# EAGLE design senseBox-Eye_v1.0 (EAGLE 9.6.2)
Assembly variants: komplett, ohne fuel-gauge

## Sheet 1 of 5
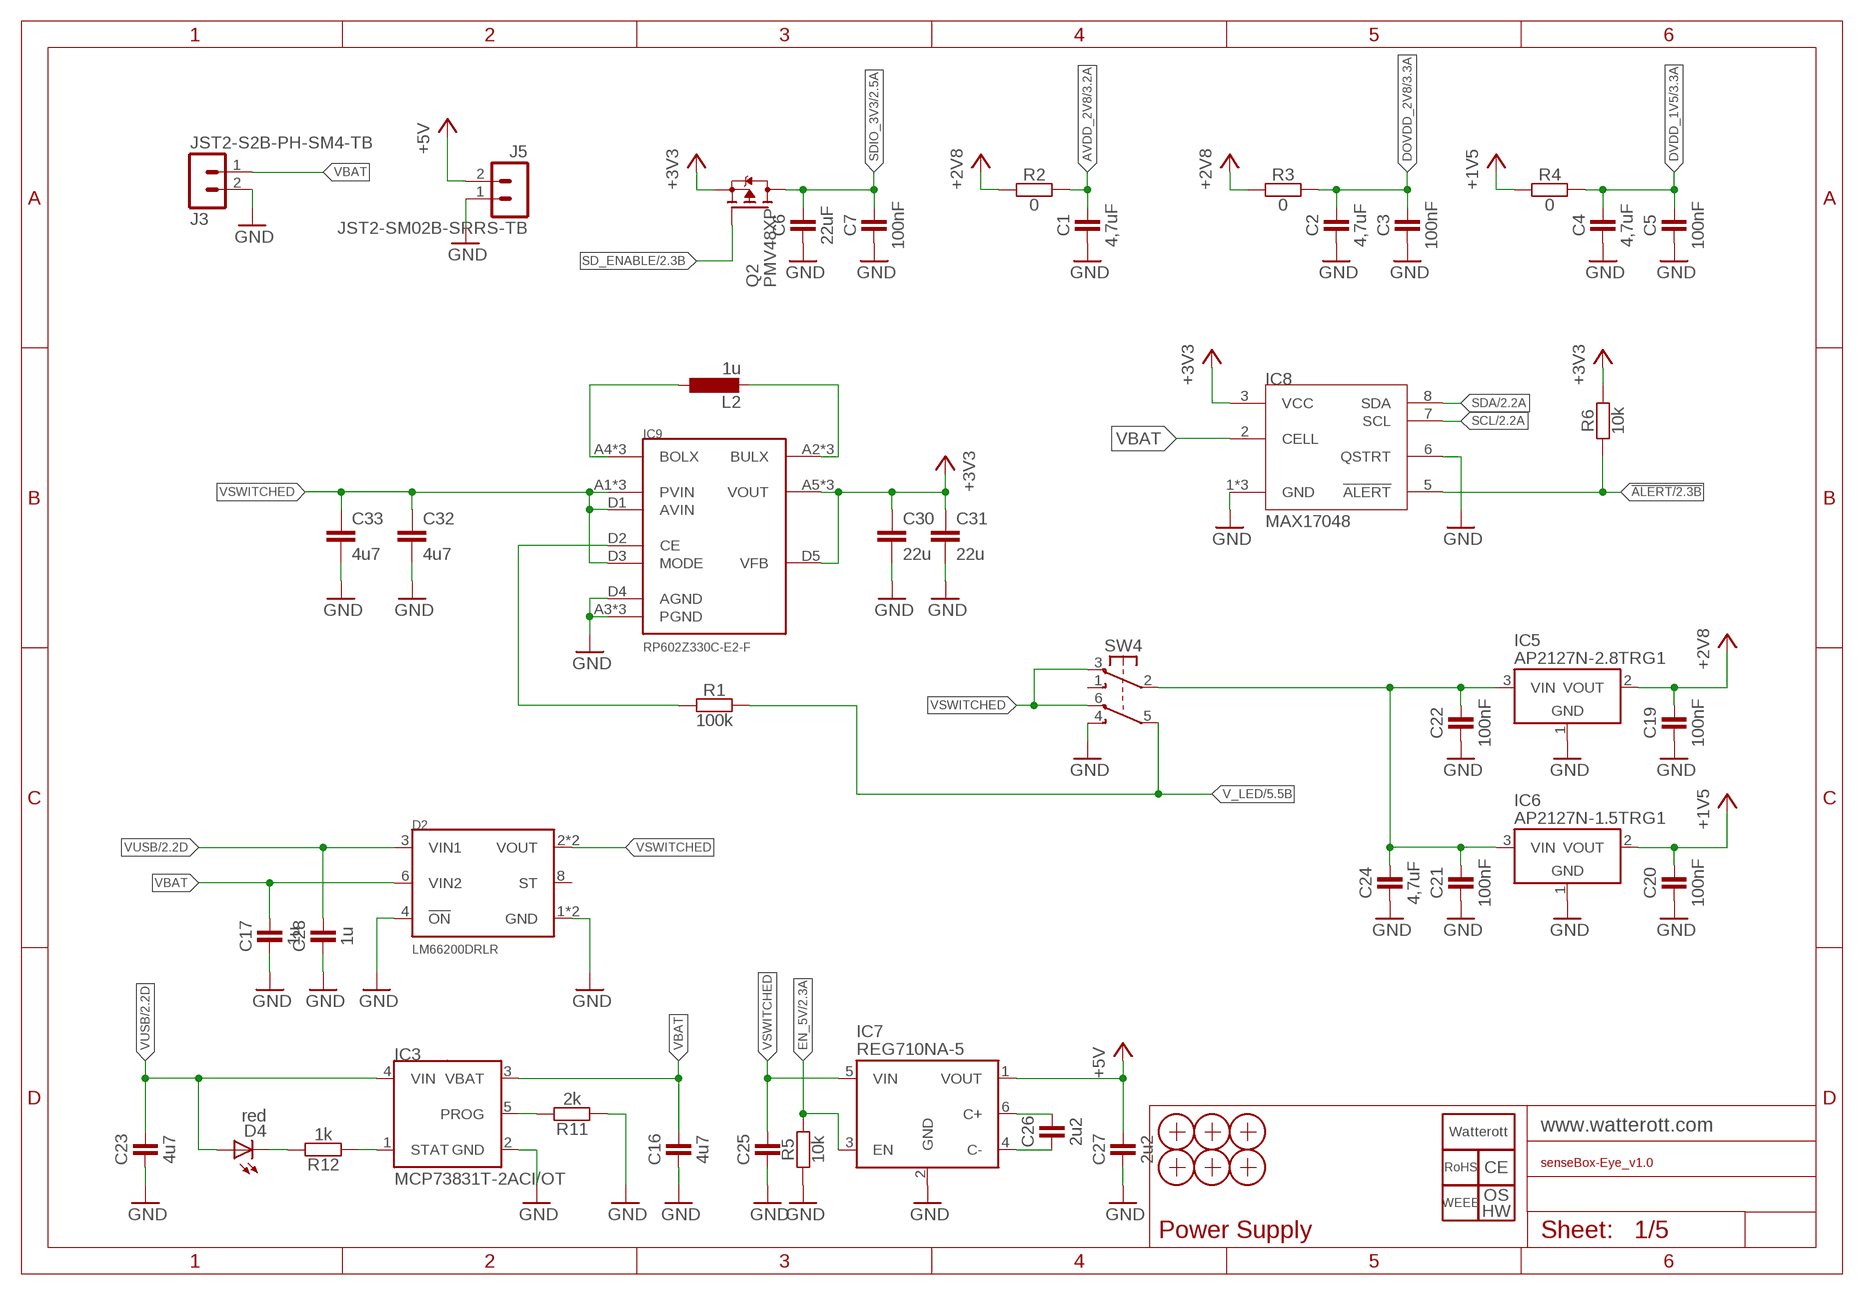
[diagram p0: schematic, sheet 1]

### Parts
C1  4,7uF  CAPACITOR-0402  [C0402]
C2  4,7uF  CAPACITOR-0402  [C0402]
C3  100nF  CAPACITOR-0402  [C0402]
C4  4,7uF  CAPACITOR-0402  [C0402]
C5  100nF  CAPACITOR-0402  [C0402]
C6  22uF  CAPACITOR-0402  [C0402]
C7  100nF  CAPACITOR-0402  [C0402]
C16  4u7  CAPACITOR-0402  [C0402]
C17  1u  CAPACITOR-0402  [C0402]
C19  100nF  CAPACITOR-0402  [C0402]
C20  100nF  CAPACITOR-0402  [C0402]
C21  100nF  CAPACITOR-0402  [C0402]
C22  100nF  CAPACITOR-0402  [C0402]
C23  4u7  CAPACITOR-0402  [C0402]
C24  4,7uF  CAPACITOR-0402  [C0402]
C25  CAPACITOR-0402  [C0402]
C26  2u2  CAPACITOR-0402  [C0402]
C27  2u2  CAPACITOR-0402  [C0402]
C28  1u  CAPACITOR-0402  [C0402]
C30  22u  C_22U_0805N  [0805N]
C31  22u  C_22U_0805N  [0805N]
C32  4u7  C_4U7_0603N  [0603N]
C33  4u7  C_4U7_0603N  [0603N]
D2  LM66200DRLR  LM66200  [SOT-5X3]
D4  red  LED_RED_0603N  [0603N]
IC3  MCP73831T-2ACI/OT  MCP73831_MCP73831T-2ACI/OT_SOT23-5  [SOT23-5]
IC5  AP2127N-2.8TRG1  VREG-TS9011-3V3  [SOT23]
IC6  AP2127N-1.5TRG1  VREG-TS9011-3V3  [SOT23]
IC7  REG710NA-5  [SOT23-6]
IC8  MAX17048  MAX1704X  [UDFN8]  (not fitted in variant ohne fuel-gauge)
IC9  RP602Z330C-E2-F  RP602_RP602Z330C-E2-F_WLCSP-20-P1  [WLCSP-20-P1]
J3  JST2-S2B-PH-SM4-TB  [JST_S2B-PH-SM4-TB]
J5  JST2-SM02B-SRRS-TB  [JST_SM02B-SRSS-TB]
L2  1u  L_WE-LQS-1U_5040  [5040]
LOGO2  LOGO_CE-2  [CE_2MM]
LOGO3  LOGO_OSHW-2  [OSHW_2MM]
LOGO4  LOGO_ROHS-2  [ROHS_2MM]
LOGO5  LOGO_WEEE-4  [WEEE_4MM]
LOGO6  LOGO_SPARK-2  [SPARK_2MM]
Q2  PMV48XP  MOSFET-P_PMV48XP_SOT23'  [SOT23]
R1  100k  RESISTOR-0402  [C0402]
R2  0  RESISTOR-0402  [C0402]
R3  0  RESISTOR-0402  [C0402]
R4  0  RESISTOR-0402  [C0402]
R5  10k  RESISTOR-0402  [C0402]
R6  10k  RESISTOR-0402  [C0402]  (not fitted in variant ohne fuel-gauge)
R11  2k  RESISTOR-0402  [C0402]
R12  1k  RESISTOR-0402  [C0402]
SW4  SW-2UM-CUS22B  [CUS22B]
X1  PASSER-04  [PASSER_04MM]
X2  PASSER-04  [PASSER_04MM]
X3  PASSER-04  [PASSER_04MM]
X4  PASSER-04  [PASSER_04MM]
X5  PASSER-04  [PASSER_04MM]
X6  PASSER-04  [PASSER_04MM]

### Nets
!ALERT: IC8.5(!ALERT) R6.1 ; also sheet 2
+1V5: C20.2 IC6.2(VOUT) R4.1
+2V8: C19.2 IC5.2(VOUT) R2.1 R3.1
+3V3: C30.1 C31.1 IC8.3(VCC) IC9.A5(VOUT) IC9.B5(VOUT) IC9.C5(VOUT) IC9.D5(VFB) Q2.2(S) R6.2 ; also sheet 2,4,5
+5V: C27.2 IC7.1(VOUT) J5.2
AVDD_2V8: C1.2 R2.2 ; also sheet 3
BOLX: IC9.A4(BOLX) IC9.B4(BOLX) IC9.C4(BOLX) L2.1
BULX: IC9.A2(BULX) IC9.B2(BULX) IC9.C2(BULX) L2.2
DOVDD_2V8: C2.2 C3.2 R3.2 ; also sheet 3
DVDD_1V5: C4.2 C5.2 R4.2 ; also sheet 3
EN_5V: IC7.3(EN) R5.2 ; also sheet 2
ENABLE_3V3: IC9.D2(CE) R1.1
GND: C1.1 C2.1 C3.1 C4.1 C5.1 C6.1 C7.1 C16.1 C17.1 C19.1 C20.1 C21.1 C22.1 C23.1 C24.1 C25.1 C27.1 C28.1 C30.2 C31.2 C32.2 C33.2 D2.1(GND) D2.4(!ON) D2.5(GND) IC3.2(GND) IC5.1(GND) IC6.1(GND) IC7.2(GND) IC8.1(GND) IC8.4(GND) IC8.6(QSTRT) IC8.TP(GND) IC9.A3(PGND) IC9.B3(PGND) IC9.C3(PGND) IC9.D4(AGND) J3.2 J5.1 R5.1 R11.1 SW4.4(NO2) ; also sheet 2,3,4,5
N$5: C26.2 IC7.6(C+)
N$6: C26.1 IC7.4(C-)
N$8: D4.C R12.2
N$9: IC3.1(STAT) R12.1
N$10: IC3.5(PROG) R11.2
SCL: IC8.7(SCL) ; also sheet 2,5
SD_ENABLE: Q2.1(G) ; also sheet 2
SDA: IC8.8(SDA) ; also sheet 2,5
SDIO_3V3: C6.2 C7.2 Q2.3(D) ; also sheet 2
V_LED: R1.2 SW4.5(C2) ; also sheet 5
VBAT: C16.2 C17.2 D2.6(VIN2) IC3.3(VBAT) IC8.2(CELL) J3.1
VIN: C21.2 C22.2 C24.2 IC5.3(VIN) IC6.3(VIN) SW4.2(C1)
VSWITCHED: C25.2 C32.1 C33.1 D2.2(VOUT) D2.7(VOUT) IC7.5(VIN) IC9.A1(PVIN) IC9.B1(PVIN) IC9.C1(PVIN) IC9.D1(AVIN) IC9.D3(MODE) SW4.3(NC1) SW4.6(NC2)
VUSB: C23.2 C28.2 D2.3(VIN1) D4.A IC3.4(VIN) ; also sheet 2
Unconnected: D2.8(ST) SW4.1(NO1)

### Notes on the sheet
- Power Supply

## Sheet 2 of 5
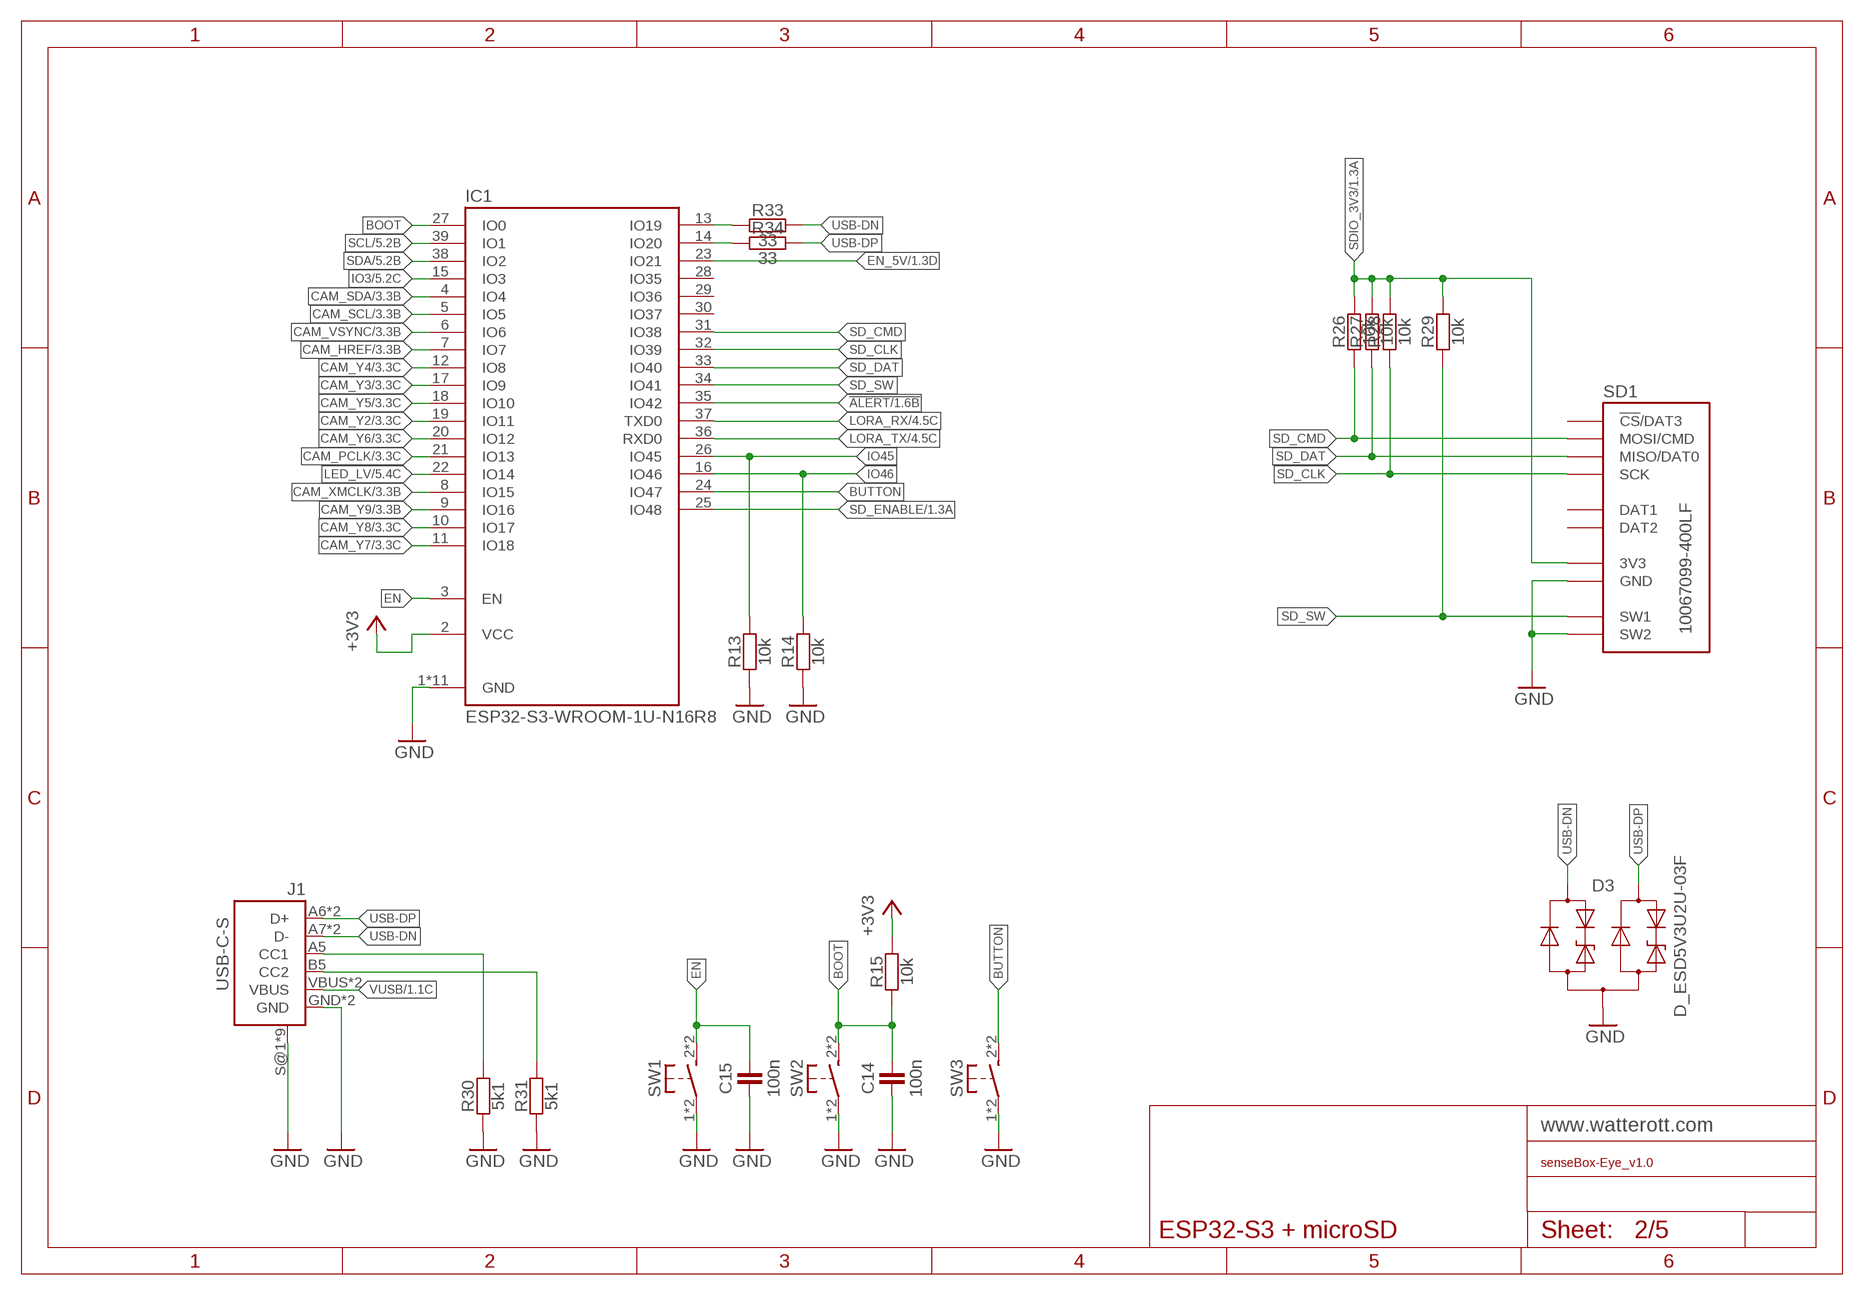
[diagram p1: schematic, sheet 2]

### Parts
C14  100n  CAPACITOR-0402  [C0402]
C15  100n  CAPACITOR-0402  [C0402]
D3  D_ESD5V3U2U-03F  [SOT723]
IC1  ESP32-S3-WROOM-1U-N16R8  ESP32_S3-WROOM-1  [ESP32-S3-WROOM-1U]
J1  USB-C-S  [USB-C-S]
R13  10k  RESISTOR-0402  [C0402]
R14  10k  RESISTOR-0402  [C0402]
R15  10k  RESISTOR-0402  [C0402]
R26  10k  RESISTOR-0402  [C0402]
R27  10k  RESISTOR-0402  [C0402]
R28  10k  RESISTOR-0402  [C0402]
R29  10k  RESISTOR-0402  [C0402]
R30  5k1  RESISTOR-0402  [C0402]
R31  5k1  RESISTOR-0402  [C0402]
R33  33  RESISTOR-0402  [C0402]
R34  33  RESISTOR-0402  [C0402]
SD1  10067099-400LF  SD-CARD-MSD47  [SD_47309XXXX]
SW1  SW-TACTILE-TL3305  [TL3305]
SW2  SW-TACTILE-TL3305  [TL3305]
SW3  SW-TACTILE-TL3305  [TL3305]

### Nets
!ALERT: IC1.35(IO42) ; also sheet 1
+3V3: IC1.2(VCC) R15.2 ; also sheet 1,4,5
BOOT: C14.2 IC1.27(IO0) R15.1 SW2.2(S1) SW2.3(S1)
BUTTON: IC1.24(IO47) SW3.2(S1) SW3.3(S1)
CAM_HREF: IC1.7(IO7) ; also sheet 3
CAM_PCLK: IC1.21(IO13) ; also sheet 3
CAM_SCL: IC1.5(IO5) ; also sheet 3
CAM_SDA: IC1.4(IO4) ; also sheet 3
CAM_VSYNC: IC1.6(IO6) ; also sheet 3
CAM_XMCLK: IC1.8(IO15) ; also sheet 3
CAM_Y2: IC1.19(IO11) ; also sheet 3
CAM_Y3: IC1.17(IO9) ; also sheet 3
CAM_Y4: IC1.12(IO8) ; also sheet 3
CAM_Y5: IC1.18(IO10) ; also sheet 3
CAM_Y6: IC1.20(IO12) ; also sheet 3
CAM_Y7: IC1.11(IO18) ; also sheet 3
CAM_Y8: IC1.10(IO17) ; also sheet 3
CAM_Y9: IC1.9(IO16) ; also sheet 3
CC1: J1.A5(CC1) R30.2
CC2: J1.B5(CC2) R31.2
EN: C15.2 IC1.3(EN) SW1.2(S1) SW1.3(S1)
EN_5V: IC1.23(IO21) ; also sheet 1
GND: C14.1 C15.1 D3.3(A) IC1.1(GND) IC1.40(GND) IC1.P$1(GND) IC1.P$2(GND) IC1.P$3(GND) IC1.P$4(GND) IC1.P$5(GND) IC1.P$6(GND) IC1.P$7(GND) IC1.P$8(GND) IC1.P$9(GND) J1.GND J1.GND2(GND) J1.S@1(SHIELD) J1.S@2(SHIELD) J1.S@3(SHIELD) J1.S@4(SHIELD) J1.S@5(SHIELD) J1.S@6(SHIELD) J1.S@7(SHIELD) J1.S@8(SHIELD) J1.S@9(SHIELD) R13.1 R14.1 R30.1 R31.1 SD1.GND SD1.GND@1(GND) SD1.GND@2(GND) SD1.SW2 SW1.1 SW1.4(P1) SW2.1 SW2.4(P1) SW3.1 SW3.4(P1) ; also sheet 1,3,4,5
IO3: IC1.15(IO3) ; also sheet 5
IO19: IC1.13(IO19) R33.1
IO20: IC1.14(IO20) R34.1
IO45: IC1.26(IO45) R13.2
IO46: IC1.16(IO46) R14.2
LED_LV: IC1.22(IO14) ; also sheet 5
LORA_RX: IC1.37(TXD0) ; also sheet 4
LORA_TX: IC1.36(RXD0) ; also sheet 4
SCL: IC1.39(IO1) ; also sheet 1,5
SD_CLK: IC1.32(IO39) R28.1 SD1.SCK
SD_CMD: IC1.31(IO38) R26.1 SD1.MOSI(MOSI/CMD)
SD_DAT: IC1.33(IO40) R27.1 SD1.MISO(MISO/DAT0)
SD_ENABLE: IC1.25(IO48) ; also sheet 1
SD_SW: IC1.34(IO41) R29.1 SD1.SW1
SDA: IC1.38(IO2) ; also sheet 1,5
SDIO_3V3: R26.2 R27.2 R28.2 R29.2 SD1.VCC(3V3) ; also sheet 1
USB-DN: D3.1(C1) J1.A7(D-) J1.B7(D-) R33.2
USB-DP: D3.2(C2) J1.A6(D+) J1.B6(D+) R34.2
VUSB: J1.VBUS J1.VBUS2(VBUS) ; also sheet 1
Unconnected: IC1.28(IO35) IC1.29(IO36) IC1.30(IO37) SD1.CS(!CS!/DAT3) SD1.DAT1 SD1.DAT2

### Notes on the sheet
- ESP32-S3 + microSD

## Sheet 3 of 5
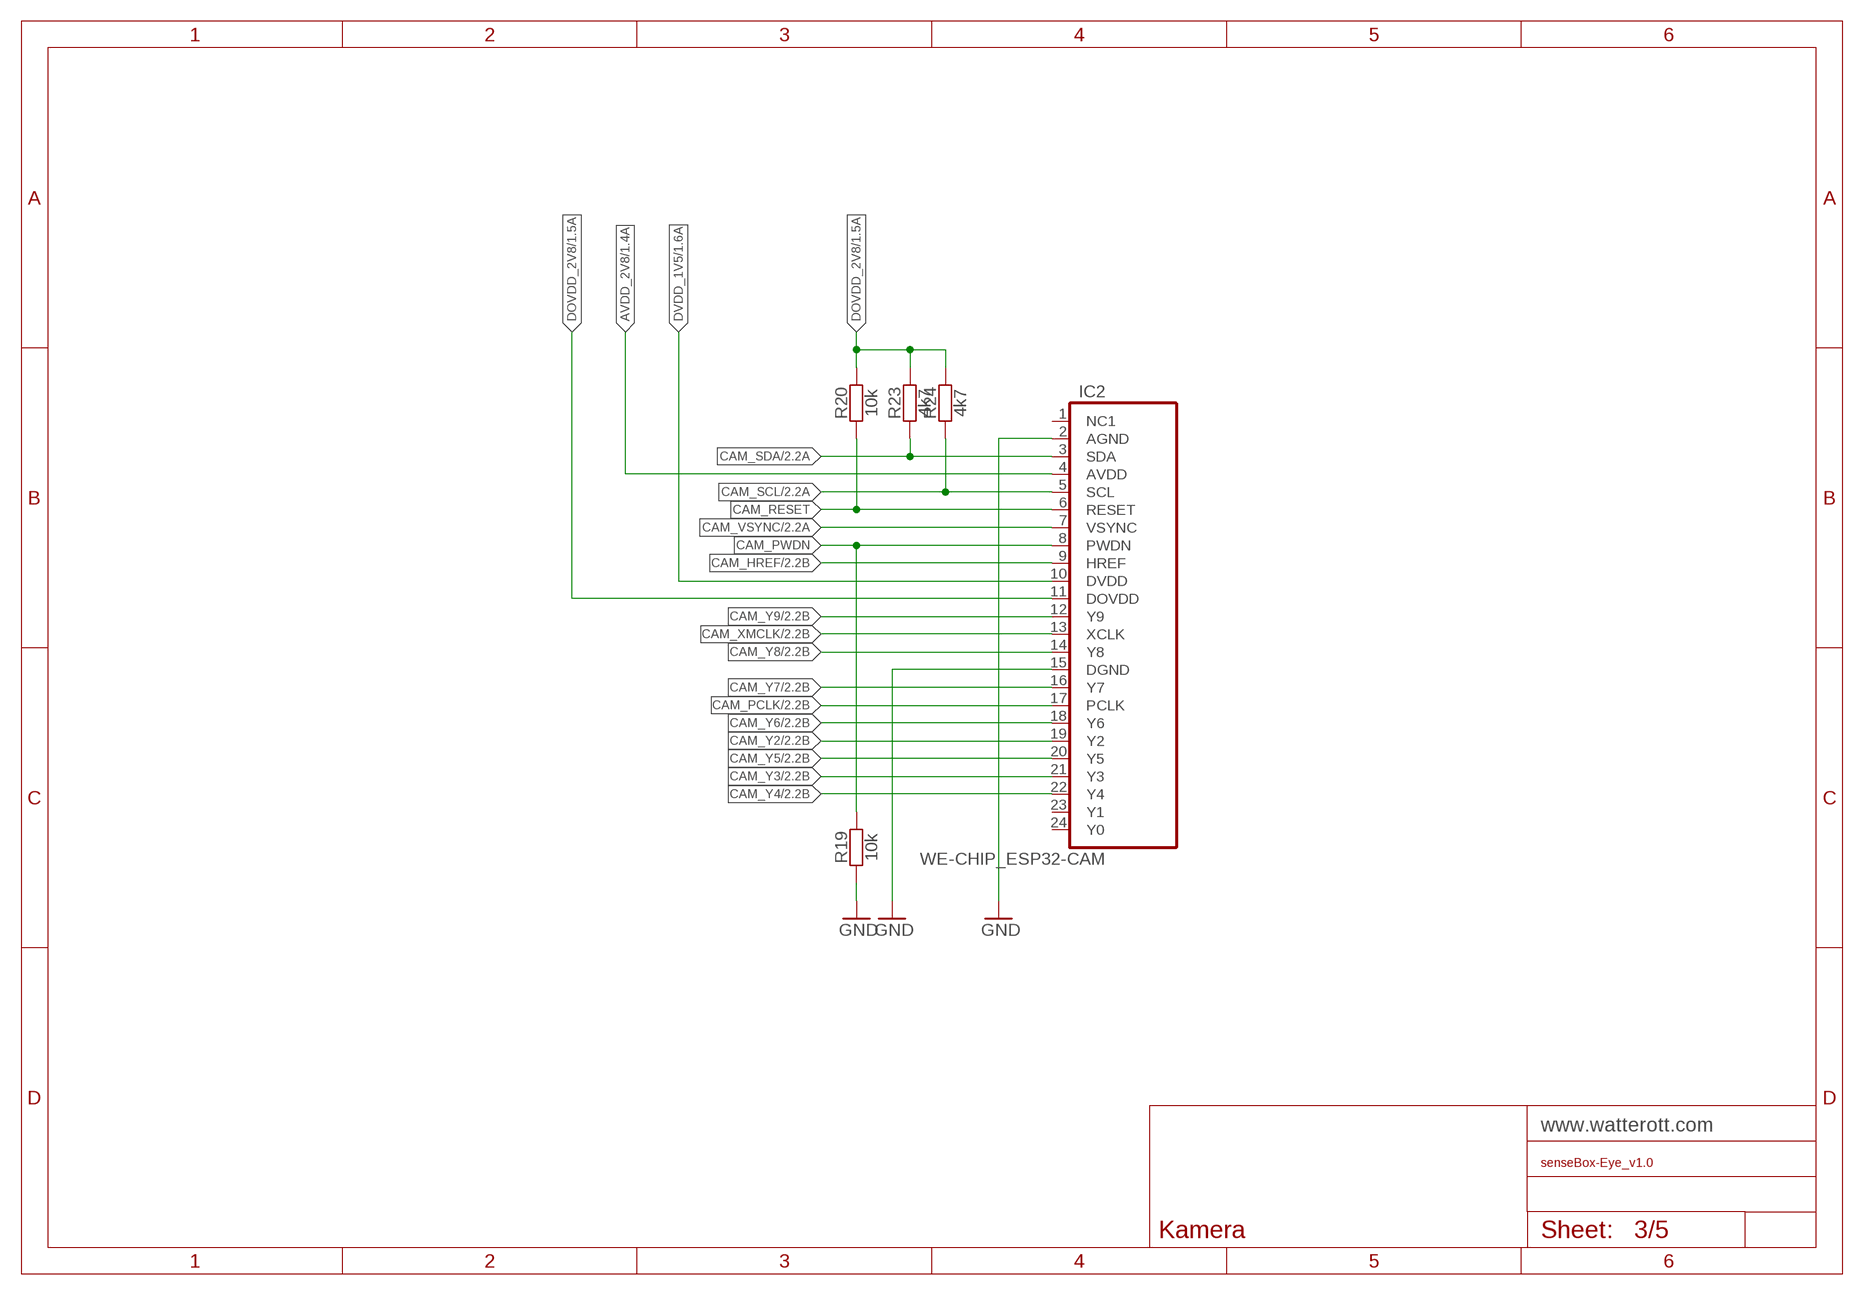
[diagram p2: schematic, sheet 3]

### Parts
IC2  WE-CHIP_ESP32-CAM  [WE-CHIP_FPC24-0.5-CAM]
R19  10k  RESISTOR-0402  [C0402]
R20  10k  RESISTOR-0402  [C0402]
R23  4k7  RESISTOR-0402  [C0402]
R24  4k7  RESISTOR-0402  [C0402]

### Nets
AVDD_2V8: IC2.4(AVDD) ; also sheet 1
CAM_HREF: IC2.9(HREF) ; also sheet 2
CAM_PCLK: IC2.17(PCLK) ; also sheet 2
CAM_PWDN: IC2.8(PWDN) R19.2
CAM_RESET: IC2.6(RESET) R20.1
CAM_SCL: IC2.5(SCL) R24.1 ; also sheet 2
CAM_SDA: IC2.3(SDA) R23.1 ; also sheet 2
CAM_VSYNC: IC2.7(VSYNC) ; also sheet 2
CAM_XMCLK: IC2.13(XCLK) ; also sheet 2
CAM_Y2: IC2.19(Y2) ; also sheet 2
CAM_Y3: IC2.21(Y3) ; also sheet 2
CAM_Y4: IC2.22(Y4) ; also sheet 2
CAM_Y5: IC2.20(Y5) ; also sheet 2
CAM_Y6: IC2.18(Y6) ; also sheet 2
CAM_Y7: IC2.16(Y7) ; also sheet 2
CAM_Y8: IC2.14(Y8) ; also sheet 2
CAM_Y9: IC2.12(Y9) ; also sheet 2
DOVDD_2V8: IC2.11(DOVDD) R20.2 R23.2 R24.2 ; also sheet 1
DVDD_1V5: IC2.10(DVDD) ; also sheet 1
GND: IC2.15(DGND) R19.1 ; also sheet 1,2,4,5
N$4: IC2.2(AGND) ; supply symbol labelled GND
Unconnected: IC2.1(NC1) IC2.23(Y1) IC2.24(Y0)

### Notes on the sheet
- Kamera

## Sheet 4 of 5
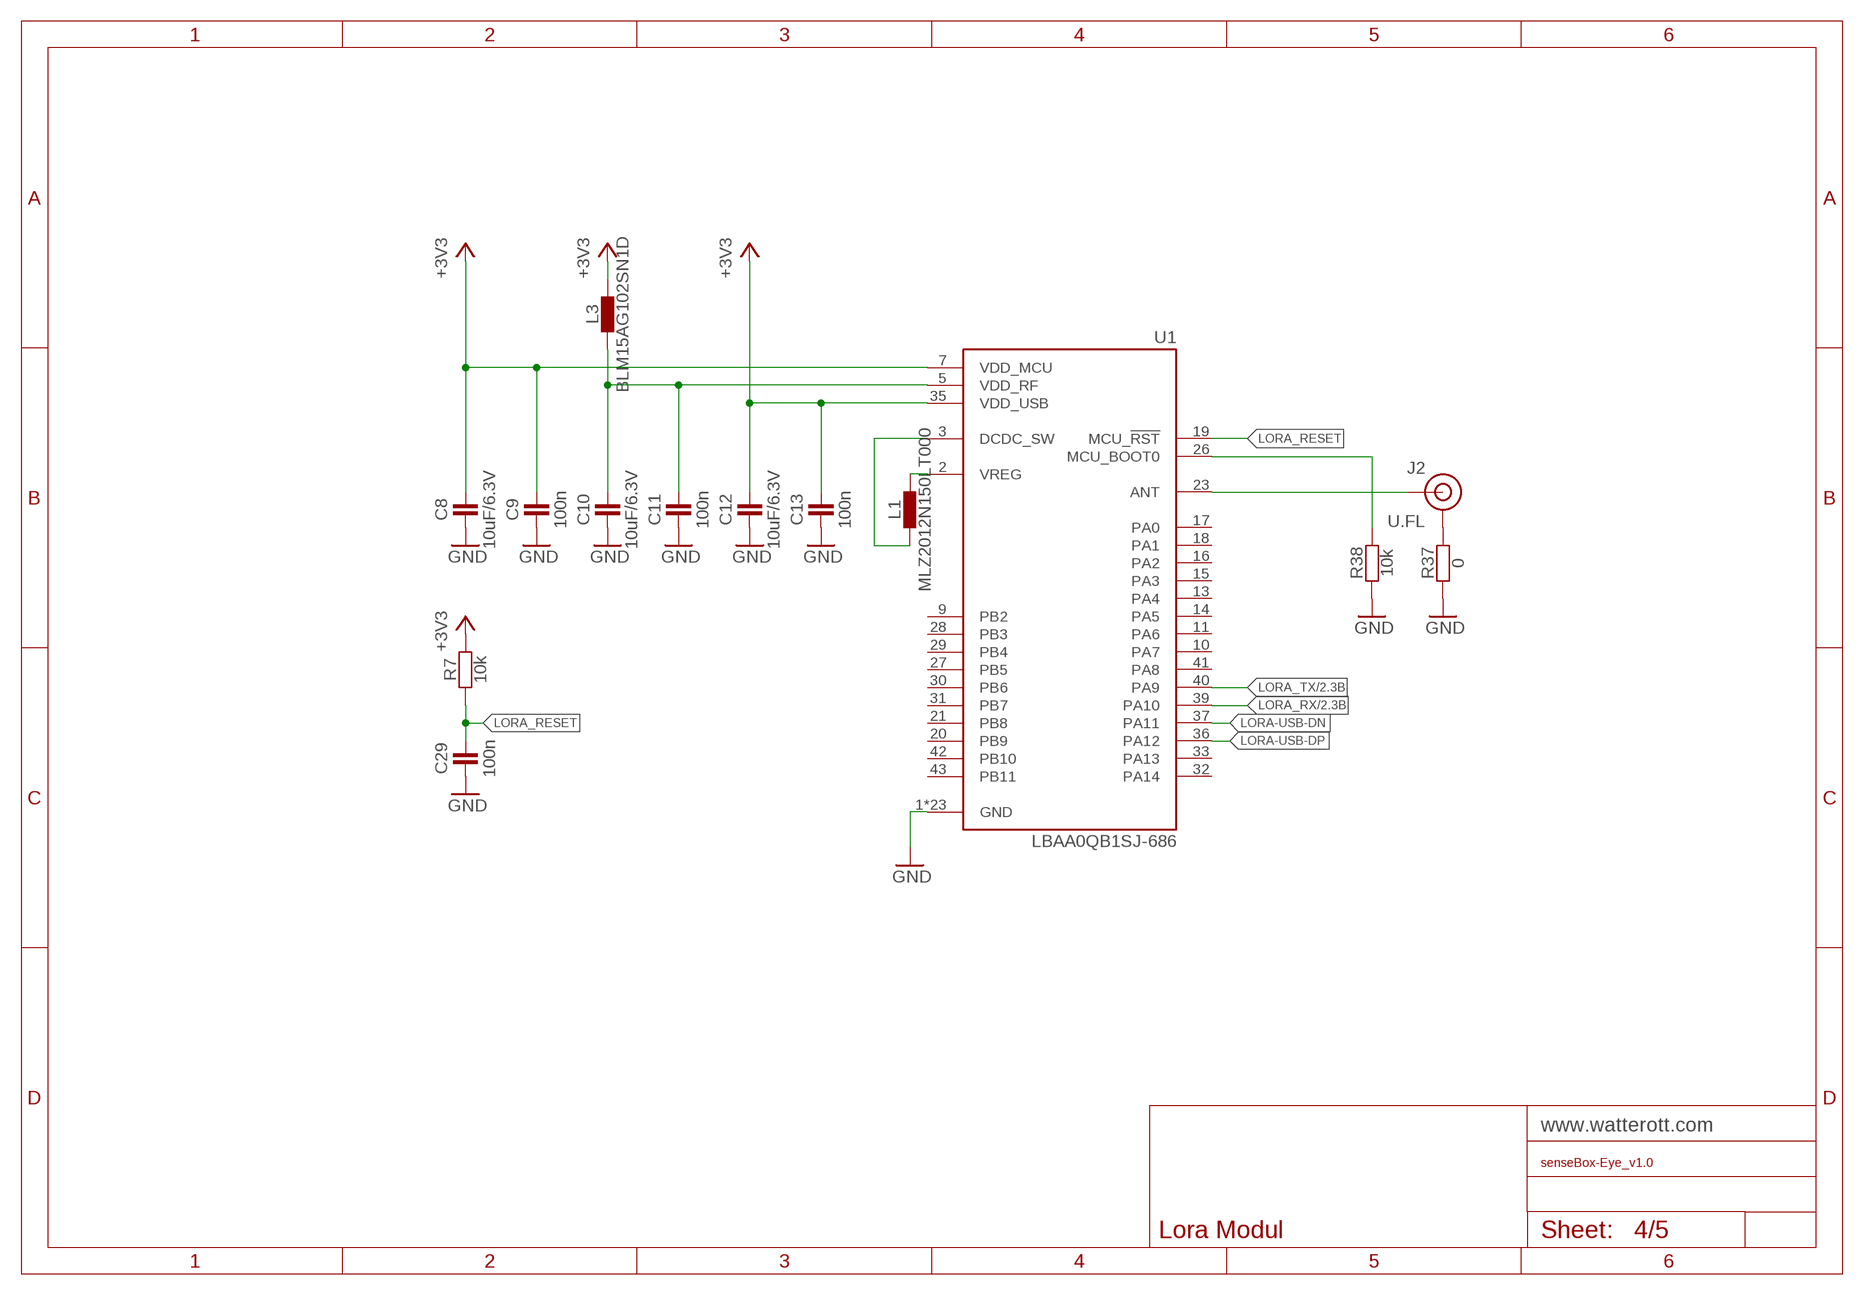
[diagram p3: schematic, sheet 4]

### Parts
C8  10uF/6.3V  CAPACITOR-0402  [C0402]
C9  100n  CAPACITOR-0402  [C0402]
C10  10uF/6.3V  CAPACITOR-0402  [C0402]
C11  100n  CAPACITOR-0402  [C0402]
C12  10uF/6.3V  CAPACITOR-0402  [C0402]
C13  100n  CAPACITOR-0402  [C0402]
C29  100n  CAPACITOR-0402  [C0402]
J2  U.FL  [U.FL]
L1  MLZ2012N150LT000  INDUCTOR-0805  [C0805]
L3  BLM15AG102SN1D  INDUCTOR-0402  [C0402]
R7  10k  RESISTOR-0402  [C0402]
R37  0  RESISTOR-0402  [C0402]
R38  10k  RESISTOR-0402  [C0402]
U1  LBAA0QB1SJ-686  LBAA0QB1SJ-296  [MODULE_LBAA0QB1SJ-296]

### Nets
+3V3: C8.2 C9.2 C12.2 C13.2 L3.2 R7.2 U1.7(VDD_MCU) U1.35(VDD_USB) ; also sheet 1,2,5
ANT: J2.FEED(SIGNAL) U1.23(ANT)
GND: C8.1 C9.1 C10.1 C11.1 C12.1 C13.1 C29.1 R37.1 R38.1 U1.1(GND) U1.4(GND) U1.6(GND) U1.8(GND) U1.12(GND) U1.22(GND) U1.24(GND) U1.25(GND) U1.34(GND) U1.38(GND) U1.44(GND) U1.45(GND) U1.46(GND) U1.47(GND) U1.48(GND) U1.49(GND) U1.50(GND) U1.51(GND) U1.52(GND) U1.53(GND) U1.54(GND) U1.55(GND) U1.56(GND) ; also sheet 1,2,3,5
LORA-USB-DN: U1.37(PA11)
LORA-USB-DP: U1.36(PA12)
LORA_RESET: C29.2 R7.1 U1.19(MCU_!RST)
LORA_RX: U1.39(PA10) ; also sheet 2
LORA_TX: U1.40(PA9) ; also sheet 2
MCU-BOOT0: R38.2 U1.26(MCU_BOOT0)
N$1: L1.2 U1.3(DCDC_SW)
N$2: L1.1 U1.2(VREG)
N$3: J2.1(GND) J2.2(GND) R37.2
N$7: C10.2 C11.2 L3.1 U1.5(VDD_RF)
Unconnected: U1.9(PB2) U1.10(PA7) U1.11(PA6) U1.13(PA4) U1.14(PA5) U1.15(PA3) U1.16(PA2) U1.17(PA0) U1.18(PA1) U1.20(PB9) U1.21(PB8) U1.27(PB5) U1.28(PB3) U1.29(PB4) U1.30(PB6) U1.31(PB7) U1.32(PA14) U1.33(PA13) U1.41(PA8) U1.42(PB10) U1.43(PB11)

### Notes on the sheet
- Lora Modul

## Sheet 5 of 5
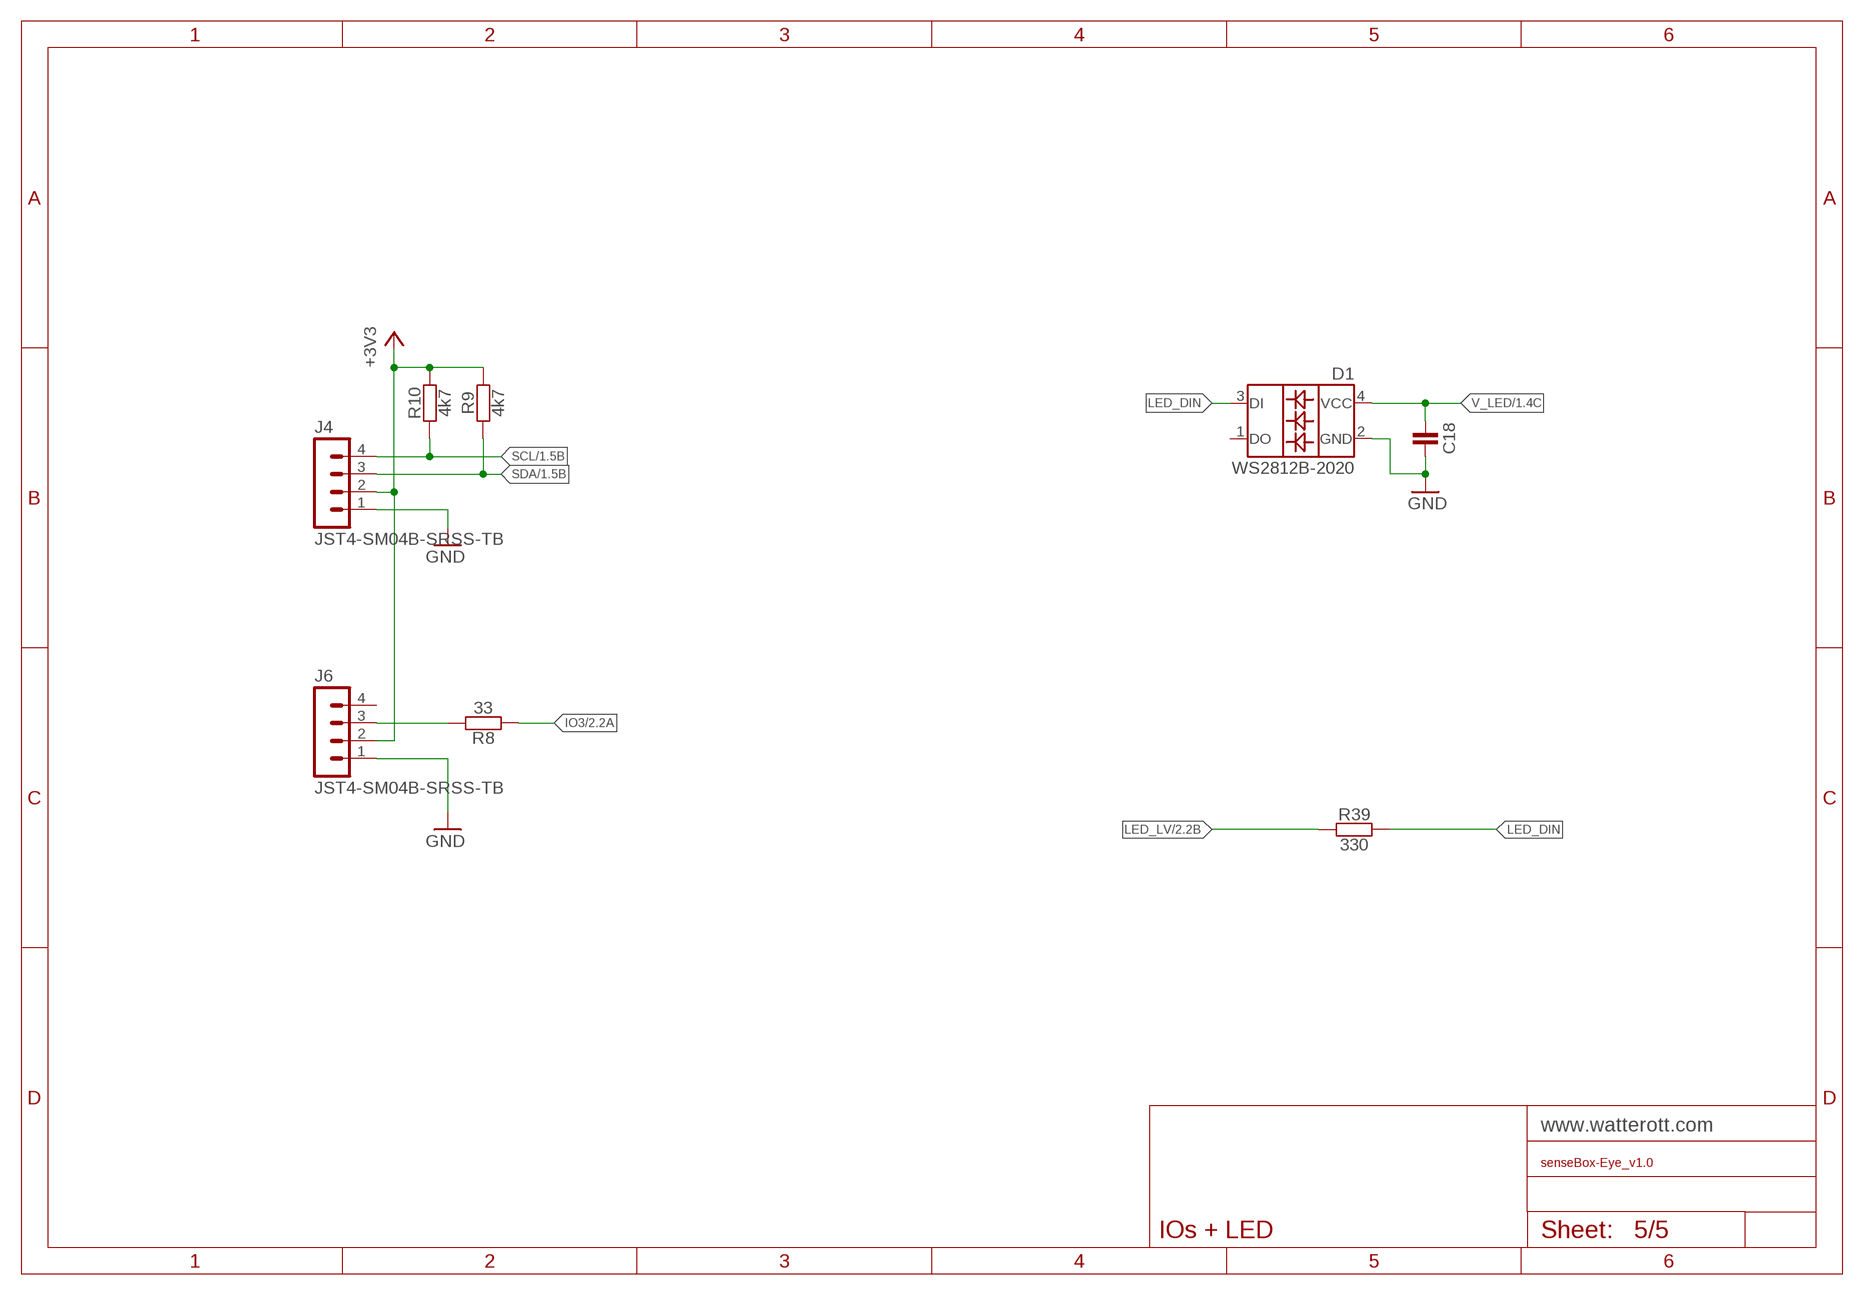
[diagram p4: schematic, sheet 5]

### Parts
C18  CAPACITOR-0402  [C0402]
D1  WS2812B-2020  [WS2812_2020]
J4  JST4-SM04B-SRSS-TB  [JST_SM04B-SRSS-TB]
J6  JST4-SM04B-SRSS-TB  [JST_SM04B-SRSS-TB]
R8  33  RESISTOR-0402  [C0402]
R9  4k7  RESISTOR-0402  [C0402]
R10  4k7  RESISTOR-0402  [C0402]
R39  330  RESISTOR-0402  [C0402]

### Nets
+3V3: J4.2 J6.2 R9.1 R10.1 ; also sheet 1,2,4
GND: C18.1 D1.2(GND) J4.1 J6.1 ; also sheet 1,2,3,4
IO3: R8.2 ; also sheet 2
LED_DIN: D1.3(DI) R39.2
LED_LV: R39.1 ; also sheet 2
N$13: J6.3 R8.1
SCL: J4.4 R10.2 ; also sheet 1,2
SDA: J4.3 R9.2 ; also sheet 1,2
V_LED: C18.2 D1.4(VCC) ; also sheet 1
Unconnected: D1.1(DO) J6.4

### Notes on the sheet
- IOs + LED

## Library data of the parts
C1-C29 = we-rcl:CAPACITOR: Capacitor ...2.2uF @ 6.3V -> 0402 ...4.7uF @ 6.3V -> 0603 ...10uF @ 16V -> 0805 ...22uF @ 25V -> 1206
C30 C31 = BE_capacitor:C: Capacitor; BE#: 208; DIELECTRIC: X5R; VOLTAGE: 6V3
C32 C33 = BE_capacitor:C: Capacitor; BE#: 284; DIELECTRIC: X5R; VOLTAGE: 6V3
D1 = we-opto:WS2812B: WS2812 RGB LED (built-in driver)
D2 = BE_diode:LM66200: LM66200 1.6-5V, 2.5A Dual Ideal Diode with Automatic Switchover; BE#: 2291
D3 = we-rcl:D_ESD5V3U2U: ESD5V3U2U TVS Diode (Uni-directional Ultra Low ESD) Vrwm=5.3V, 0.4pF@1MHz; DIGIKEY: ESD5V3U2U-03F H6327DKR-ND
D4 = BE_opto:LED: Single LED; BE#: 224
IC1 = we-chip:ESP32_S3-WROOM-1: Espressif ESP32-S3-WROOM-1U ESP32 WiFi/WLAN + Bluetooth/BLE Module<
IC2 = SenseBox-Eye:WE-CHIP_ESP32-CAM: ESP32-CAM OV2640 Camera module
IC3 = BE_dcdc:MCP73831: Miniature Single-Cell, Fully Integrated Li-Ion, Li-Polymer Charge Management Controllers up to 500mA; BE#: 2283
IC5 IC6 = we-power:VREG: Voltage Regulator LDOs Taiwan Semi TS1117 800mA max 15V - compatible On Semi NCP1117 1A max 20V - compatible Diodes AP2111H 0.6A max 6V (0.25V@0.6A) - compatible Diodes AP2114H 1A max 6V (0.45V@1A) Taiwan Semi TS9011 250mA max 12V - compatible Diodes AP2210 300mA max 15V - compatible Microchip MCP1700 250mA max 6.5V - compatible Microchip MCP1702 250mA max 13V - compatible Microchip MCP1703 250mA max 16V - compatible Microchip MCP1754 150mA max 16V Taiwan Semi TS5204 80mA max 16V (low noise) DC/DC Converter Modules Recom R-78Ex.x-1.0-W36 1A max 28V - compatible CUI V78xx-2000 2A max 18V Murata OKI-78SR-x.x/1.5-W36 1.5A max 36V
IC7 = we-power:REG710NA: TI REG710xx Charge Pump with Regulated Output TI REG710xx (60mA) 5.5V - REG71055 5.0V - REG710NA-5 or REG71050 3.3V - REG710NA-3.3 3.0V - REG710NA-3 2.7V - REG710NA-2.7 2.5V - REG710NA-2.5 Diodes AP3602 (100mA) 5.0V - AP3602A 4.5V - AP3602B OnSemi CAT3200 (100mA) 5.0V - CAT3200TDI
IC8 = we-power:MAX1704X
IC9 = BE_dcdc:RP602: 1.5 A PWM/VFM Buck-Boost DC/DC Converter with Synchronous Rectifier; BE#: 2281
J1 = we-con:USB-C: USB-C Connector Hroparts TYPE-C-31-M-12 or Jing C167321 or XKB U262-161N-4BVC11 Up: XKB U263-241N-4BQC11-1 or Wuerth 632722110112
J2 = we-con:U.FL: U.FL Connector
J3 J5 = we-con:JST2: JST Connector
J4 J6 = we-con:JST4: JST Connector
L1 L3 = we-rcl:INDUCTOR: Inductor Ferrite Bead - Murata BLM18PG 0603 3.0A 33Ohm @ 100MHz -> BLM18PG330SN1D 0603 2.0A 120Ohm @ 100MHz -> BLM18PG121SN1D 0603 1.4A 220Ohm @ 100MHz -> BLM18PG221SN1D 0603 1.2A 330Ohm @ 100MHz -> BLM18PG331SN1D 0603 1.0A 470Ohm @ 100MHz -> BLM18PG471SN1D L4040 BOURNS SRN4018 Serie
L2 = BE_inductor:L: Inductor; BE#: 2282; CURRENT: 4.9; INDUCTANCE: 1u
LOGO2 = we-symbol:LOGO_CE: CE Logo
LOGO3 = we-symbol:LOGO_OSHW: Open-Source-Hardware Logo
LOGO4 = we-symbol:LOGO_ROHS: RoHS Logo
LOGO5 = we-symbol:LOGO_WEEE: WEEE Logo
LOGO6 = we-symbol:LOGO_SPARK: Watterott electronic Logo
Q2 = BE_transistor:MOSFET-P: Single P-Channel Mosfet; BE#: 271; CURRENT: 3.5; VOLTAGE: 20
R1-R15 R19 R20 R23 R24 R26-R31 R33 R34 R37-R39 = we-rcl:RESISTOR: Resistor all kinds in 0402 and 0603
SD1 = we-con:SD-CARD: SD-Card Socket
SW1-SW3 = we-switch:SW-TACTILE: Tactile Switche
SW4 = we-switch:SW-2UM: Switch; DIGIKEY: 563-1105-6-ND
U1 = LBAA0QB1SJ-296:LBAA0QB1SJ-296; MANUFACTURER: Murata; MAXIMUM_PACKAGE_HEIGHT: 1.6 mm; PARTREV: F; STANDARD: Manufacturer Recommendations
X1-X6 = we-symbol:PASSER: Fiducial Marker

## Board
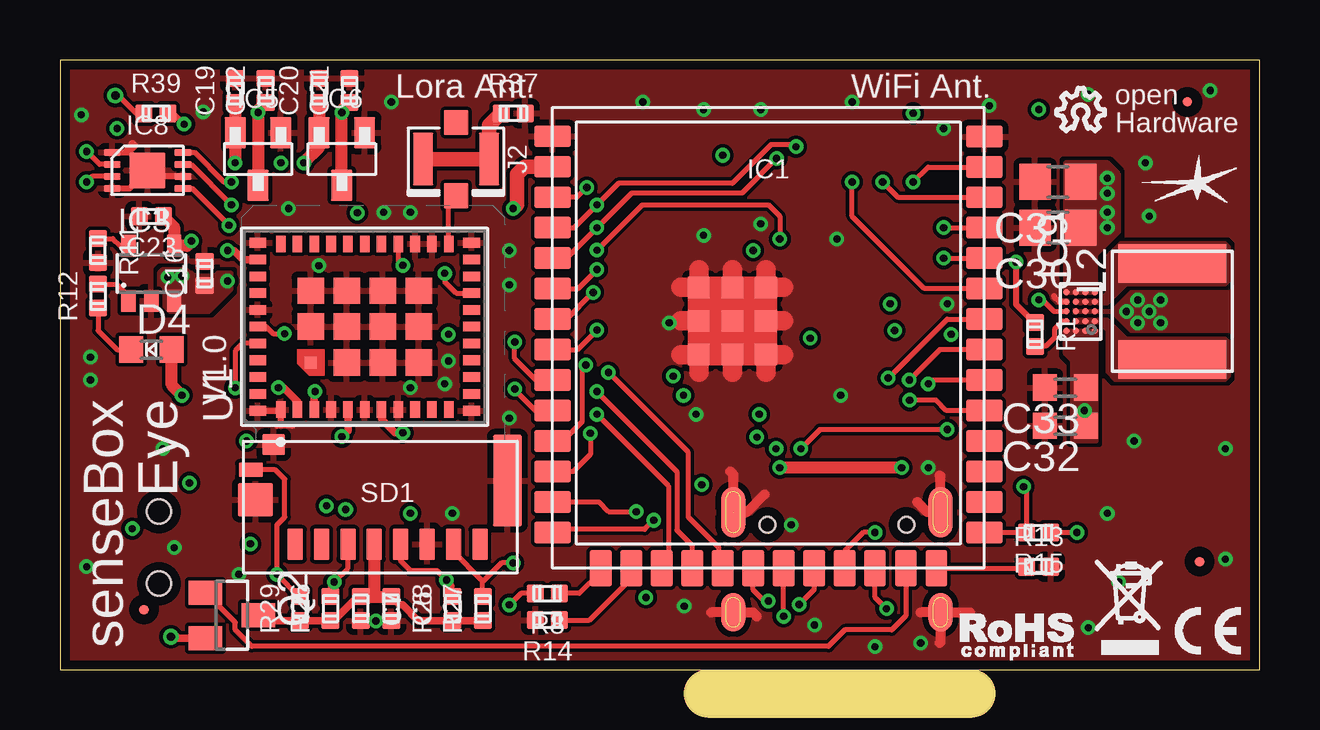
[diagram p5: board, top side]
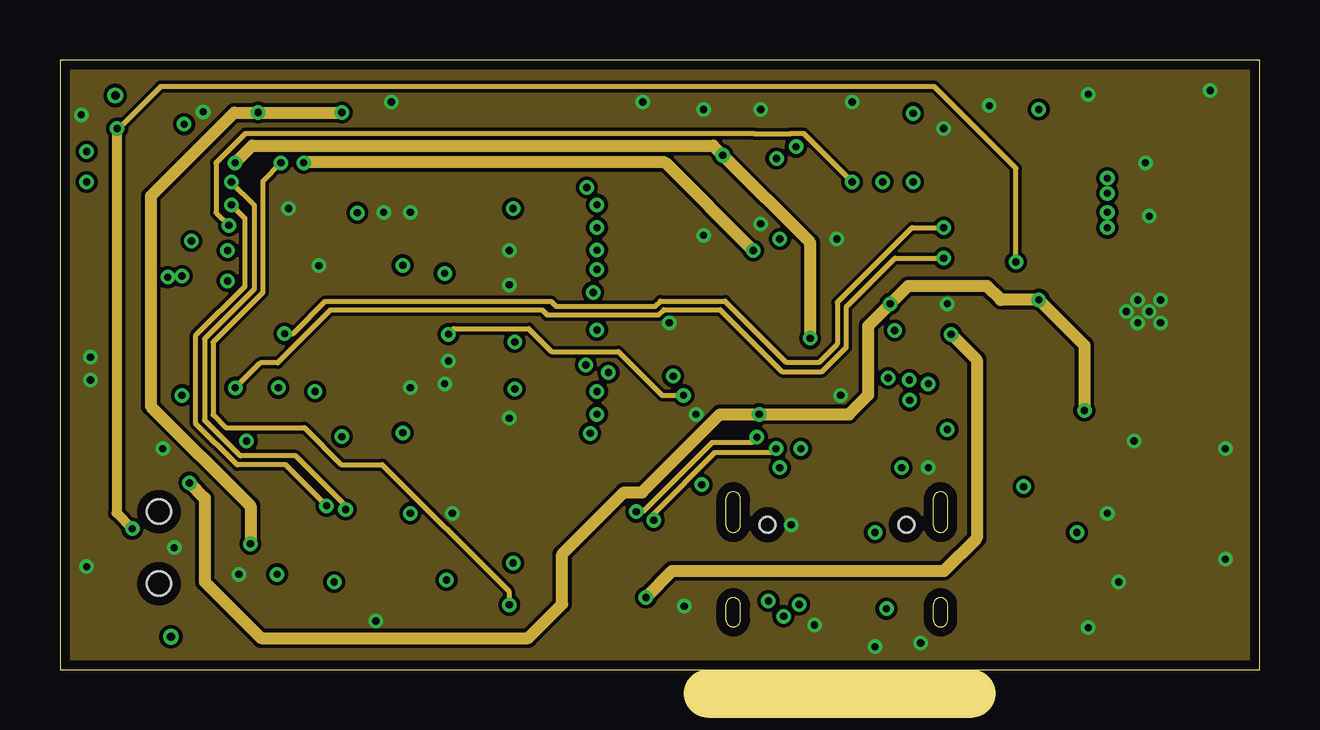
[diagram p6: board, inner layer Route2]
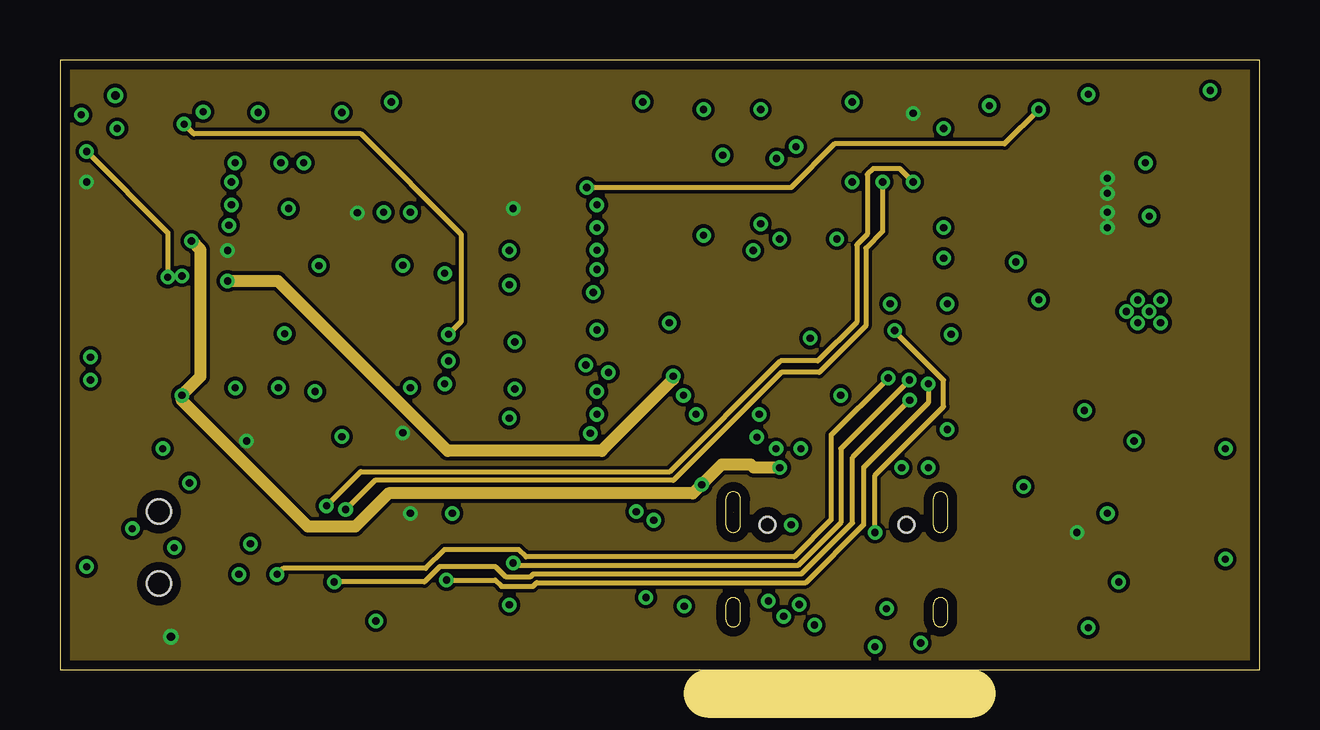
[diagram p7: board, inner layer Route15]
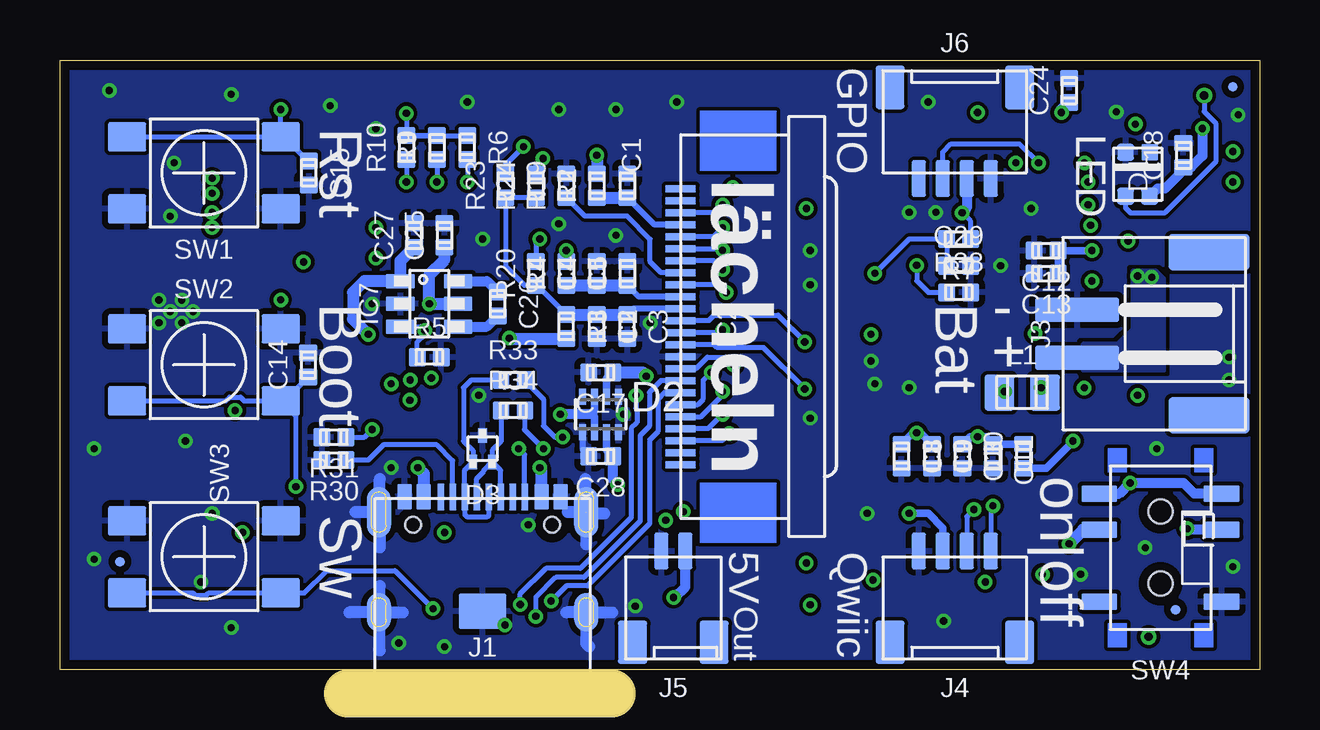
[diagram p8: board, bottom side, seen from below]

Size 50 x 25.4 mm. Coordinates in mm from the lower left corner, seen from the top.
Outline: 0,0 50,0 50,25.4 0,25.4 0,0
Copper layers (1+2*15+16): Top 0.035mm / dielectric 0.35mm / Route2 0.035mm / dielectric 0.76mm / Route15 0.035mm / dielectric 0.35mm / Bottom 0.035mm
Design rules "we-dru-4-layer": minimum track width 6mil, minimum drill 0.3mm, track to track 6mil, track to pad 6mil, pad to pad 8mil, via to via 8mil, smd to smd 4mil, copper to edge 0.4mm, drill to drill 0.4mm, minimum pad ring 6mil, minimum via ring 6mil, stop-mask expansion 0.1mm, vias tented up to drill 0.5mm, thermal gap 0.25mm
Milling: 1 lines

### Footprints (pad centres in the part's own frame; a part is rotated, then mirrored left to right if it is on the bottom)
C0402 = smd 0.75 x 0.7: 1 0,0.5; 2 0,-0.5
0805N = smd 1.3 x 1.5: 1 -0.95,0; 2 0.95,0
0603N = smd 1 x 1.1: 1 -0.85,0; 2 0.85,0
WS2812_2020 = smd 0.7 x 0.7: 1 -0.915,0.5; 2 -0.915,-0.5; 3 0.915,-0.5; 4 0.915,0.5
SOT-5X3 = smd 0.3 x 0.67: 1 -0.75,-0.74; 2 -0.25,-0.74; 3 0.25,-0.74; 4 0.75,-0.74; 5 0.75,0.74; 6 0.25,0.74; 7 -0.25,0.74; 8 -0.75,0.74
SOT723 = smd 0.6 x 0.4: 1 -0.55,0.4; 2 -0.55,-0.4; 3 0.55,0
0603N' = smd 1 x 1.1: A 0.85,0; C -0.85,0
ESP32-S3-WROOM-1U = smd 1.5 x 0.9: 1 -9,8.255; 2 -9,6.985; 3 -9,5.715; 4 -9,4.445; 5 -9,3.175; 6 -9,1.905; 7 -9,0.635; 8 -9,-0.635; 9 -9,-1.905; 10 -9,-3.175; 11 -9,-4.445; 12 -9,-5.715; 13 -9,-6.985; 14 -9,-8.255; 27 9,-8.255; 28 9,-6.985; 29 9,-5.715; 30 9,-4.445; 31 9,-3.175; 32 9,-1.905; 33 9,-0.635; 34 9,0.635; 35 9,1.905; 36 9,3.175; 37 9,4.445; 38 9,5.715; 39 9,6.97; 40 9,8.24 | smd 0.9 x 1.5: 15 -6.985,-9.745; 16 -5.715,-9.745; 17 -4.445,-9.745; 18 -3.175,-9.745; 19 -1.905,-9.745; 20 -0.635,-9.745; 21 0.635,-9.745; 22 1.905,-9.745; 23 3.175,-9.745; 24 4.445,-9.745; 25 5.73,-9.745; 26 7,-9.745 | smd 0.9 x 0.9: P$1 -1.5,0.555; P$2 -0.1,0.555; P$3 -0.1,-0.845; P$4 -1.5,-0.845; P$5 -2.9,-0.845; P$6 -2.9,0.555; P$7 -2.9,1.955; P$8 -1.5,1.955; P$9 -0.1,1.955
WE-CHIP_FPC24-0.5-CAM = smd 1.27 x 0.279: 1 0,5.75; 2 0,5.25; 3 0,4.75; 4 0,4.25; 5 0,3.75; 6 0,3.25; 7 0,2.75; 8 0,2.25; 9 0,1.75; 10 0,1.25; 11 0,0.75; 12 0,0.25; 13 0,-0.25; 14 0,-0.75; 15 0,-1.25; 16 0,-1.75; 17 0,-2.25; 18 0,-2.75; 19 0,-3.25; 20 0,-3.75; 21 0,-4.25; 22 0,-4.75; 23 0,-5.25; 24 0,-5.75
SOT23-5 = smd 0.6 x 0.9: 1 -0.95,-1.15; 2 0,-1.15; 3 0.95,-1.15; 4 0.95,1.15; 5 -0.95,1.15
SOT23 = smd 1.3 x 0.9: 1 -1.1,0.95; 2 -1.1,-0.95; 3 1.1,0
SOT23-6 = smd 1.2 x 0.6: 1 -1.2,0.95; 2 -1.2,0; 3 -1.2,-0.95; 4 1.2,-0.95; 5 1.2,0; 6 1.2,0.95
UDFN8 = smd 0.7 x 0.28: 1 -1.475,0.75; 2 -1.475,0.25; 3 -1.475,-0.25; 4 -1.475,-0.75; 5 1.475,-0.75; 6 1.475,-0.25; 7 1.475,0.25; 8 1.475,0.75 | smd 1.5 x 1.5: TP 0,0
WLCSP-20-P1 = smd 0.265 x 0.265: A1 -0.8,-0.6; A2 -0.4,-0.6; A3 0,-0.6; A4 0.4,-0.6; A5 0.8,-0.6; B1 -0.8,-0.2; B2 -0.4,-0.2; B3 0,-0.2; B4 0.4,-0.2; B5 0.8,-0.2; C1 -0.8,0.2; C2 -0.4,0.2; C3 0,0.2; C4 0.4,0.2; C5 0.8,0.2; D1 -0.8,0.6; D2 -0.4,0.6; D3 0,0.6; D4 0.4,0.6; D5 0.8,0.6
USB-C-S = smd 1.1 x 0.3: A5 -1.155,-1.25; A6 -1.155,-0.25; A7 -1.155,0.25; A8 -1.155,1.25; B5 -1.155,1.75; B6 -1.155,0.75; B7 -1.155,-0.75; B8 -1.155,-1.75 | smd 1.05 x 0.6: GND -1.175,3.25; GND2 -1.175,-3.25; VBUS -1.175,2.45; VBUS2 -1.175,-2.45 | smd 2.1 x 1: S@1 -0.53,4.32; S@5 -0.53,-4.32 | smd 2.1 x 1 bottom: S@2 -0.53,4.32; S@6 -0.53,-4.32 | smd 1.6 x 1: S@3 3.65,4.32; S@7 3.65,-4.32 | smd 1.6 x 1 bottom: S@4 3.65,4.32; S@8 3.65,-4.32 | smd 1.5 x 2: S@9 3.6,0 | hole 0.65: 0,-2.89; 0,2.89
U.FL = smd 2.2 x 0.85: 1 0,1.375; 2 0,-1.375 | smd 1.05 x 1: FEED 1.525,0; NC -1.525,0
JST_S2B-PH-SM4-TB = smd 3.5 x 1: 1 1,1; 2 1,-1 | smd 3.4 x 1.5: SHLD1 -4.5,3.4; SHLD2 -4.5,-3.4
JST_SM04B-SRSS-TB = smd 1.5 x 0.6: 1 2.4,1.5; 2 2.4,0.5; 3 2.4,-0.5; 4 2.4,-1.5 | smd 1.8 x 1.2: SHLD1 -1.4,-2.7; SHLD2 -1.4,2.7
JST_SM02B-SRSS-TB = smd 1.5 x 0.6: 1 2.4,0.5; 2 2.4,-0.5 | smd 1.8 x 1.2: SHLD1 -1.4,-1.7; SHLD2 -1.4,1.7
C0805 = smd 1.5 x 1.25: 1 0,0.95; 2 0,-0.95
5040 = smd 1.6 x 4.5: 1 -2,0; 2 2,0
SOT23' = smd 1 x 1.4: 1 -0.95,-1.1; 2 0.95,-1.1; 3 0,1.1
SD_47309XXXX = smd 0.65 x 1.3: CS 2.75,4.3; DAT1 -3.85,4.3; DAT2 3.85,4.3; GND -1.65,4.3; MISO -2.75,4.3; MOSI 1.65,4.3; SCK -0.55,4.3; VCC 0.55,4.3 | smd 1.2 x 3.8: GND@1 -5,1.65 | smd 1.45 x 1.4: GND@2 5.5,2.45 | smd 1 x 0.6: SW1 5.7,1.2 | smd 0.95 x 0.85: SW2 4.75,0.15
TL3305 = smd 1.6 x 1.2: 1 -3.2,1.5; 2 -3.2,-1.5; 3 3.2,-1.5; 4 3.2,1.5
CUS22B = smd 0.7 x 1.5: 1 -2.25,2.55; 2 0.75,2.55; 3 2.25,2.55; 4 -2.25,-2.55; 5 0.75,-2.55; 6 2.25,-2.55 | hole 1: -1.5,0; 1.5,0
MODULE_LBAA0QB1SJ-296 = smd 0.7 x 0.4: 1 -3.45,3.5; 2 -3.45,2.8; 3 -3.45,2.1; 4 -3.45,1.4; 5 -3.45,0.7; 6 -3.45,0; 7 -3.45,-0.7; 8 -3.45,-1.4; 9 -3.45,-2.1; 10 -3.45,-2.8; 11 -3.45,-3.5; 23 3.45,-3.5; 24 3.45,-2.8; 25 3.45,-2.1; 26 3.45,-1.4; 27 3.45,-0.7; 28 3.45,0; 29 3.45,0.7; 30 3.45,1.4; 31 3.45,2.1; 32 3.45,2.8; 33 3.45,3.5 | smd 0.4 x 0.7: 12 -3.5,-4.45; 13 -2.8,-4.45; 14 -2.1,-4.45; 15 -1.4,-4.45; 16 -0.7,-4.45; 17 0,-4.45; 18 0.7,-4.45; 19 1.4,-4.45; 20 2.1,-4.45; 21 2.8,-4.45; 22 3.5,-4.45; 34 3.5,4.45; 35 2.8,4.45; 36 2.1,4.45; 37 1.4,4.45; 38 0.7,4.45; 39 0,4.45; 40 -0.7,4.45; 41 -1.4,4.45; 42 -2.1,4.45; 43 -2.8,4.45; 44 -3.5,4.45 | smd 0.5 x 0.5: 45 -1.5,2.25 | smd 1.1 x 1.1: 46 -1.5,0.75; 47 -1.5,-0.75; 48 -1.5,-2.25; 49 0,-2.25; 50 1.5,-2.25; 51 1.5,-0.75; 52 1.5,0.75; 53 1.5,2.25; 54 0,2.25; 55 0,0.75; 56 0,-0.75
PASSER_04MM = smd 0.4 x 0.4: X 0,0

### Placement (x,y rotation side)
C1  26.35,20.16 0 bottom
C2  27.62,14.29 180 bottom
C3  26.35,14.29 180 bottom
C4  27.62,16.51 0 bottom
C5  26.35,16.51 0 bottom
C6  13.81,2.54 180 top
C7  12.54,2.54 180 top
C8  14.92,8.89 180 bottom
C9  13.65,8.89 180 bottom
C10  12.38,8.89 180 bottom
C11  11.11,8.89 180 bottom
C12  8.89,17.46 90 bottom
C13  8.89,16.51 90 bottom
C14  39.66,12.7 0 bottom
C15  39.62,20.7 180 bottom
C16  6.03,16.51 0 top
C17  27.46,12.38 90 bottom
C18  3.17,21.43 0 bottom
C19  7.3,24.13 0 top
C20  10.79,24.13 0 top
C21  12.06,24.13 0 top
C22  8.57,24.13 0 top
C23  3.81,18.89 90 top
C24  7.94,24.13 0 bottom
C25  33.97,18.1 0 bottom
C26  31.75,15.24 180 bottom
C27  35.24,18.1 0 bottom
C28  27.46,8.89 90 bottom
C29  12.54,16.83 270 bottom
C30  41.59,18.41 180 top
C31  41.59,20.32 180 top
C32  41.91,10.16 180 top
C33  41.91,11.75 180 top
D1  5.08,20.64 270 bottom
D2  27.46,10.64 0 bottom
D3  32.38,9.21 90 bottom
D4  red  [0603N']  3.81,13.34 0 top
IC1  29.53,13.97 0 top
IC2  24.13,14.29 0 bottom
IC3  3.81,16.51 0 top
IC5  8.26,21.27 270 top
IC6  11.75,21.27 270 top
IC7  34.61,15.24 0 bottom
IC8  3.65,20.8 0 top
IC9  42.55,14.92 90 top
J1  32.38,6.03 270 bottom
J2  16.51,21.27 270 top
J3  6.6,14 180 bottom
J4  12.7,2.54 90 bottom
J5  24.43,2.54 90 bottom
J6  12.7,22.86 270 bottom
L1  9.89,11.54 270 bottom
L2  46.35,14.92 270 top
L3  9.84,8.89 0 bottom
LOGO2  47.85,1.61 0 top
LOGO3  42.55,23.34 0 top
LOGO4  39.89,1.38 0 top
LOGO5  44.53,2.6 0 top
LOGO6  47.41,20.25 180 top
Q2  PMV48XP  [SOT23']  7.16,2.26 270 top
R1  40.64,13.97 180 top
R2  27.62,20.16 0 bottom
R3  28.89,14.29 180 bottom
R4  28.89,16.51 0 bottom
R5  34.61,13.02 270 bottom
R6  33.02,21.75 180 bottom
R7  12.54,17.94 90 bottom
R8  20.32,3.17 90 top
R9  34.29,21.75 0 bottom
R10  35.56,21.75 0 bottom
R11  1.59,17.46 180 top
R12  1.59,15.56 0 top
R13  40.8,4.29 270 top
R14  20.32,2.06 90 top
R15  40.8,5.71 90 top
R19  28.89,20.16 0 bottom
R20  30.16,16.51 0 bottom
R23  31.43,20.16 0 bottom
R24  30.16,20.16 0 bottom
R26  11.27,2.54 0 top
R27  17.62,2.54 0 top
R28  16.35,2.54 0 top
R29  10,2.54 0 top
R30  38.58,8.73 90 bottom
R31  38.58,9.68 90 bottom
R33  31.11,12.06 270 bottom
R34  31.11,10.79 270 bottom
R37  18.89,23.18 270 top
R38  12.54,15.72 270 bottom
R39  4,23.18 270 top
SD1  13.65,9.53 180 top
SW1  44,20.7 180 bottom
SW2  44,12.7 0 bottom
SW3  44,4.7 0 bottom
SW4  4.13,5.08 90 bottom
U1  12.7,14.29 90 top
X1  47.5,4.5 0 top
X2  3.5,2.5 0 top
X3  46.99,23.65 0 top
X4  47.5,4.5 0 bottom
X5  1.11,24.29 0 bottom
X6  3.5,2.5 0 bottom

### Tracks (layer width: path | path; a pad name or v marks a point on that pad's centre or on a via)
!ALERT  (via drill 0.3)
  Top 0.2: IC8.5 5.51,20.05 v7.04,18.51 | IC1.35 36.04,15.88 33.02,18.89 v33.02,20.32
  Route2 0.2: v7.04,18.51 6.51,19.04 6.51,21.11 7.73,22.34 28.94,22.34 28.96,22.33 30.43,22.33 30.45,22.34 31,22.34 v33.02,20.32
  Bottom 0.2: R6.1 v33.02,20.32
+1V5  (via drill 0.3)
  Top 0.508: C20.2 IC6.2 10.8,21.75 v10.16,21.11
  Route2 0.508: v10.16,21.11 10.19,21.14 25.22,21.14 v28.89,17.46
  Bottom 0.508: v28.89,17.46 R4.1
+2V8  (via drill 0.3)
  Top 0.508: C19.2 IC5.2 v7.3,21.12 v7.3,21.11
  Route2 0.508: v7.3,21.11 8.02,21.83 27.22,21.83 v27.62,21.43 31.27,17.78 v31.27,13.81
  Bottom 0.508: v27.62,21.43 R2.1 | v31.27,13.81 31.25,13.79 R3.1
+3V3  (via drill 0.3, 0.35)
  Top 0.2: IC8.3 1.34,20.55 v1.11,20.32 | R15.2 v42.39,5.71
  Top 0.305: U1.7 13.4,10.44 13.97,9.87 v14.29,9.87 | U1.35 7.64,17.09 7.26,17.46 v6.99,17.46 | Q2.2 4.94,1.31 4.85,1.4 4.65,1.4 v4.62,1.37
  Top 0.61: IC1.2 19.37,20.95 19.05,20.64 19.05,19.37 v18.89,19.21
  Bottom 0.2: R10.1 R9.1 | R9.1 R6.2 | v35.56,23.18 35.56,22.41 35.4,22.25 R9.1 | R7.2 12.04,18.68 v12.4,19.03
  Bottom 0.305: J4.2 13.2,5.9 13.81,6.51 v14.61,6.51 | C8.2 14.45,9.87 v14.29,9.87 14.13,9.87 C9.2 | L3.2 8.89,8.39 7.78,9.5 v7.78,9.53 | C13.2 C12.2 v6.99,17.46
  Bottom 0.406: J6.2 12.2,19.23 v12.4,19.03
  other vias: 43.66,20.48 43.66,19.84 43.66,19.05 43.66,18.41
  pour Route15 (rank 6): -3.17,29.53 -3.17,-5.4 52.23,-5.4 52.23,29.53
  pour Top (no thermals): 41.91,21.11 41.91,15.72 43.18,15.72 43.18,17.3 44.13,18.26 44.13,20.64 43.66,21.11
+5V  (via drill 0.3)
  Route2 0.508: v24.42,3 24.42,3.02 25.51,4.12 36.85,4.12 38.21,5.48 38.21,12.9 v37.15,13.97
  Bottom 0.406: 24.36,3.01 23.93,3.44 J5.2
  Bottom 0.508: C27.2 35.81,17.03 IC7.1 37.31,16.19 37.78,15.72 37.78,14.61 v37.15,13.97 | v24.42,3 24.41,3.01 24.36,3.01
ANT
  Top 0.2: U1.23 16.2,19.44 J2.FEED
AVDD_2V8
  Bottom 0.254: IC2.4 25.23,18.54 C1.2
  Bottom 0.508: R2.2 C1.2
BOLX
  pour Top (rank 2, no thermals): 42.23,15.4 42.23,15.24 43.66,15.24 44.45,16.03 48.58,16.03 48.74,16.19 48.74,17.62 48.58,17.78 44.13,17.78 43.66,17.3 43.66,15.72 43.34,15.4
BOOT  (via drill 0.3)
  Top 0.2: IC1.27 R15.1 40.3,7.49 v40.16,7.62
  Bottom 0.2: C14.2 39.66,12.19 40.64,11.2 SW2.3 | SW2.3 40.16,10.56 v40.16,7.62 | SW2.2 43.08,11.2 42.93,11.35 42.47,11.35 42.32,11.2 SW2.3
BULX
  pour Top (rank 2, no thermals): 42.23,14.61 43.66,14.61 44.45,13.81 48.58,13.81 48.74,13.65 48.74,12.22 48.58,12.06 43.97,12.06 43.66,12.38 43.66,14.13 43.34,14.45 42.23,14.45
BUTTON  (via drill 0.3)
  Top 0.2: v34.45,2.54 33.97,3.02 IC1.24
  Bottom 0.2: v34.45,2.54 36.04,4.13 38.89,4.13 39.82,3.2 SW3.3 43.8,3.2 43.9,3.1 44.36,3.1 44.47,3.2 SW3.2
CAM_HREF  (via drill 0.3)
  Top 0.2: IC1.7 21.11,14.61 v22.23,15.72
  Bottom 0.2: v22.23,15.72 22.55,16.04 IC2.9
CAM_PCLK  (via drill 0.3)
  Top 0.2: v30.16,2.22 IC1.21
  Bottom 0.2: IC2.17 24.95,12.04 25.43,11.55 25.43,10.13 25.82,9.75 25.82,6.19 28.16,3.85 29.33,3.85 30.16,3.02 v30.16,2.22
CAM_PWDN
  Bottom 0.2: IC2.8 24.95,16.54 25.4,16.99 25.4,17.94 26.35,18.89 28.12,18.89 R19.2
CAM_RESET  (via drill 0.3)
  Top 0.2: v22.38,17.48 24.27,19.37 29.53,19.37 30,18.89 v30,17.94
  Bottom 0.2: IC2.6 22.45,17.54 v22.38,17.48 | v30,17.94 30.16,17.78 R20.1
CAM_SCL  (via drill 0.3)
  Top 0.2: IC1.5 21.11,17.14 v22.38,18.41 23.82,19.86 28.43,19.86 v29.87,21.3
  Bottom 0.2: v22.38,18.41 22.76,18.04 IC2.5 | R24.1 30.16,21 v29.87,21.3
CAM_SDA  (via drill 0.3)
  Top 0.2: IC1.4 21.43,18.41 v22.38,19.37 23.27,20.26 28.02,20.26 29.64,21.87 30.6,21.87 v30.68,21.79
  Bottom 0.2: v22.38,19.37 22.71,19.04 IC2.3 | R23.1 31.43,21.04 v30.68,21.79
CAM_VSYNC  (via drill 0.3)
  Top 0.2: IC1.6 21.59,15.88 v22.38,16.67
  Bottom 0.2: v22.38,16.67 22.75,17.04 IC2.7
CAM_XMCLK  (via drill 0.3)
  Top 0.2: IC1.8 21.57,13.34 v22.38,14.15
  Bottom 0.2: v22.38,14.15 22.49,14.04 IC2.13
CAM_Y2  (via drill 0.3)
  Top 0.2: v22.86,12.38 26.19,9.05 26.19,6.35 27.46,5.08 27.46,4.38 IC1.19
  Bottom 0.2: IC2.19 23.41,11.04 23.18,11.27 23.18,12.06 v22.86,12.38
CAM_Y3  (via drill 0.3)
  Top 0.2: IC1.17 25.36,4.5 25.36,7.66 v22.38,10.64
  Bottom 0.2: v22.38,10.64 22.98,10.04 IC2.21
CAM_Y4  (via drill 0.3)
  Top 0.2: v22.1,9.84 22.11,9.83 22.11,8.97 21.4,8.26 IC1.12
  Bottom 0.2: IC2.22 22.41,9.54 v22.1,9.84
CAM_Y5  (via drill 0.3)
  Top 0.2: IC1.18 26.35,5.18 25.72,5.81 25.72,8.25 v22.38,11.58 v22.38,11.59
  Bottom 0.2: IC2.20 23.28,10.54 22.38,11.43 v22.38,11.59
CAM_Y6  (via drill 0.3)
  Top 0.2: v29.53,2.86 29.37,2.86 28.89,3.33 IC1.20
  Bottom 0.2: IC2.18 24.82,11.54 25.08,11.27 25.08,9.91 25.41,9.58 25.41,6.1 28.02,3.49 28.89,3.49 v29.53,2.86
CAM_Y7  (via drill 0.3)
  Top 0.2: v21.92,12.69 21.76,12.53 21.76,10.33 20.95,9.53 IC1.11
  Bottom 0.2: IC2.16 23.5,12.54 23.02,13.02 22.24,13.02 v21.92,12.69
CAM_Y8  (via drill 0.3)
  Top 0.2: v18.95,11.69 18.95,11.66 19.82,10.79 IC1.10
  Bottom 0.2: IC2.14 22.74,13.54 22.61,13.41 20.68,13.41 v18.95,11.69
CAM_Y9  (via drill 0.3)
  Top 0.2: IC1.9 19.84,12.06 18.95,12.95 v18.95,13.65
  Bottom 0.2: v18.95,13.65 20.07,14.77 22.73,14.77 22.96,14.54 IC2.12
CC1
  Bottom 0.2: J1.A5 33.63,8.71 34.29,9.37 36.51,9.37 37.15,8.73 R30.2
CC2  (via drill 0.3)
  Top 0.2: v36.99,10 31.68,10 v30.88,9.21
  Bottom 0.2: R31.2 37.31,9.68 v36.99,10 | J1.B5 30.64,8.96 v30.88,9.21
DOVDD_2V8
  Bottom 0.2: R3.2 30.11,16.01 R20.2 30.64,16.01 31.43,16.8 R23.2 R24.2
  Bottom 0.254: IC2.11 26.1,15.04 C3.2
  Bottom 0.508: C3.2 C2.2 R3.2
DVDD_1V5
  Bottom 0.254: IC2.10 25.88,15.54 C5.2
  Bottom 0.508: C5.2 C4.2 R4.2
EN  (via drill 0.3)
  Top 0.2: v21.96,20.09 21.56,19.68 IC1.3
  Route15 0.2: v21.96,20.09 30.47,20.09 32.29,21.91 39.37,21.91 v40.8,23.34
  Bottom 0.2: SW1.2 40.69,22.2 39.69,21.2 C15.2 | SW1.2 v40.8,23.34 | SW1.3 SW1.2
EN_5V  (via drill 0.3)
  Top 0.2: IC1.23 32.7,4.92 33.5,5.71 v33.97,5.71
  Route15 0.2: v33.97,5.71 33.97,8.1 36.83,10.95 36.83,12.06 34.79,14.11 v34.79,14.13
  Bottom 0.2: R5.2 35.11,13.65 34.79,13.97 v34.79,14.13 34.95,14.29 IC7.3
ENABLE_3V3
  Top 0.2: IC9.D2 41.79,14.52 41.47,14.21 41.47,13.85 41.12,13.49 40.66,13.49 R1.1
GND  (via drill 0.3)  (1 unrouted)
  Top 0.2: IC1.P$1 IC1.P$4
  Top 0.254: IC8.6 3.9,20.55 IC8.TP | IC8.1 2.7,21.55 | 2.7,21.55 2.9,21.55 IC8.TP | 2.7,21.55 3.02,21.86 3.02,21.91 | IC8.4 2.9,20.05 IC8.TP | U1.44 9.15,10.79 U1.1 9.2,10.31 9.05,10.16 9.68,10.16 | IC9.D4 41.67,15.32 41.43,15.56
  Top 0.305: 3.02,21.91 3.1,21.83 3.02,21.75
  Top 0.406: 27.15,2.38 J1.S@4 28.89,2.38 29.05,2.22 | J1.S@7 35.88,2.38 | J1.S@7 37.94,2.38 | J1.S@7 36.7,1.15 36.67,1.11 | 35.72,6.99 36.14,6.56 J1.S@5 36.7,8.06 36.67,8.1 | 27.94,8.26 28.07,8.13 J1.S@1 28.63,6.56 29.37,7.3
  Top 0.813: 25.88,15.93 IC1.P$7 26.63,16.67 | IC1.P$8 28.03,16.67 | 29.43,16.67 IC1.P$9 30.16,15.93 | IC1.P$2 30.16,14.53 | 30.16,13.12 IC1.P$3 29.43,12.38 | IC1.P$4 28.03,12.38 | 26.63,12.38 IC1.P$5 25.88,13.12 | IC1.P$6 25.88,14.53
  Bottom 0.254: D2.1 28.21,9.14 C28.1
  Bottom 0.508: J1.S@4 26.99,2.38 | J1.S@4 28.07,1.08 27.94,0.95 | J1.S@7 36.7,0.83 36.67,0.79 | J1.S@7 37.94,2.38 | J1.S@7 35.72,2.38 | J1.S@5 36.67,6.53 36.67,5.08 | J1.S@5 36.67,6.6 36.67,7.94 | J1.S@5 37.68,6.56 | J1.S@7 36.67,2.42 36.67,3.49 | J1.S@1 28.07,5.21 | J1.S@1 28.01,6.51 27.3,6.51 | J1.S@1 28.84,6.56 | J1.S@1 28.1,6.6 28.1,7.94 | J1.S@4 28.89,2.38
  other vias: 47.94,24.13 44.45,14.92 44.93,15.4 44.93,14.45 45.88,15.4 45.4,14.92 45.88,14.45 32.54,11.43 36.2,8.41 31.45,1.85 35.88,1.11 26.02,2.64 16.35,6.51 30.48,6.03 16.19,12.86 16.03,11.91 14.61,11.75 14.61,19.05 13.49,19.05 9.53,19.21 13.81,23.65 24.29,23.65 26.83,23.34 29.21,23.34 32.38,17.94 26.83,18.1 36.83,22.54 33.02,23.65 38.73,23.5 45.24,21.11 42.86,23.97 45.4,18.89 44.77,9.53 48.58,9.21 43.66,6.51 44.13,3.65 48.58,4.6 42.86,1.75 33.97,0.95 18.73,17.46 18.73,16.03 18.73,10.48 10.79,16.83 1.27,13.02 1.27,12.06 4.29,9.21 4.76,5.08 1.11,4.29 13.17,2.03 7.46,3.97 26.51,10.64 25.4,14.45 29.21,18.57 36.99,15.24 0.89,23.11 5.97,23.24
  pour Bottom (rank 6): -3.49,29.84 -3.49,-5.71 52.55,-5.71 52.55,29.84
  pour Route2 (rank 6): -2.86,29.21 -2.86,-5.08 51.91,-5.08 51.91,29.21
  pour Top (isolate 0.152, rank 6): -2.54,28.89 -2.54,-4.76 51.59,-4.76 51.59,28.89
  pour Top (rank 5): 42.23,15.08 42.23,14.76 43.81,14.76 44.61,13.97 48.58,13.97 48.74,14.13 48.74,15.72 48.58,15.88 44.61,15.88 43.81,15.08
IO3
  Top 0.2: IC1.15 22.54,4.07 21.65,3.17 R8.2
IO19  (via drill 0.3)
  Top 0.2: IC1.13 22.46,6.99 22.87,6.58 v24.02,6.58
  Route2 0.2: v24.02,6.58 24.3,6.58 27.17,9.46 28.82,9.46 v29.05,9.68
  Bottom 0.2: R33.1 30.61,12.04 29.84,11.27 29.84,10.16 29.37,9.68 v29.05,9.68
IO20  (via drill 0.3)
  Top 0.2: v24.75,6.22 24.37,5.84 20.65,5.84 IC1.14
  Route2 0.2: v24.75,6.22 24.75,6.5 27.3,9.05 29.69,9.05 v29.84,9.21
  Bottom 0.2: v29.84,9.21 30.64,10 30.64,10.77 R34.1
IO45
  Top 0.2: IC1.26 40.24,4.22 R13.2
IO46
  Top 0.2: R14.2 22.07,2.06 23.81,3.81 IC1.16
LED_DIN  (via drill 0.35)
  Top 0.2: R39.2 3.17,23.18 2.43,23.92 v2.31,23.92
  Bottom 0.2: D1.3 5.58,19.23 5.37,19.02 3.96,19.02 1.83,21.15 1.83,22.77 2.31,23.25 v2.31,23.92
LED_LV  (via drill 0.3)
  Top 0.2: IC1.22 31.43,3.33 v30.81,2.71 | R39.1 4.72,23.18 v5.17,22.73
  Route2 0.2: v16.19,13.97 16.19,13.99 16.41,14.21 19.53,14.21 20.49,13.25 23.28,13.25 25.09,11.43 v25.99,11.43
  Route15 0.2: v5.17,22.73 5.58,22.32 12.54,22.32 16.73,18.14 16.73,14.5 v16.19,13.97
  Bottom 0.2: v30.81,2.71 30.81,3.16 29.75,4.22 28.31,4.22 26.19,6.34 26.19,10.05 25.96,10.29 25.96,10.87 25.99,10.9 v25.99,11.43
LORA_RESET  (via drill 0.3)
  Top 0.2: U1.19 16.52,15.69 16.03,16.17 v16.03,16.51
  Bottom 0.2: C29.2 R7.1 14.61,17.94 v16.03,16.51
LORA_RX  (via drill 0.3)
  Top 0.2: U1.39 8.59,14.29 8.88,13.99 v9.36,13.99 | v36.83,18.41 IC1.37
  Route2 0.2: v36.83,18.41 35.52,18.41 32.4,15.3 32.4,13.56 31.66,12.81 30.26,12.81 27.73,15.35 25.02,15.35 24.81,15.14 20.68,15.14 20.48,15.34 11.06,15.34 9.72,13.99 v9.36,13.99
LORA_TX  (via drill 0.3)
  Top 0.2: U1.40 7.62,13.59 7.3,13.28 v7.3,11.74 | v36.83,17.14 IC1.36
  Route2 0.2: v7.3,11.74 8.34,12.78 9.08,12.78 11.28,14.99 20.1,14.99 20.3,14.78 24.95,14.78 25.17,15 27.51,15 30.1,12.41 31.76,12.41 32.77,13.42 32.77,15.11 34.8,17.14 v36.83,17.14
MCU-BOOT0  (via drill 0.3)
  Top 0.2: U1.26 14.1,17.03 v14.29,16.84
  Bottom 0.2: v14.29,16.84 14.29,16.19 13.81,15.72 R38.2
N$1  (via drill 0.3)
  Top 0.305: v10.63,11.59 10.6,11.55 U1.3
  Bottom 0.2: L1.2 10.8,11.59 v10.63,11.59
N$2  (via drill 0.3)
  Top 0.305: v9.11,11.75 9.32,11.75 9.9,11.17 U1.2
  Bottom 0.305: v9.11,11.75 8.94,11.59 L1.1
N$3
  Top 0.61: R37.2 17.89,22.67 J2.1 J2.2
N$5
  Bottom 0.406: IC7.6 32.2,16.19 C26.2
N$6
  Bottom 0.406: IC7.4 32.2,14.29 C26.1
N$7  (via drill 0.3)
  Top 0.305: U1.5 12,9.96 v11.75,9.71
  Bottom 0.305: L3.1 C11.2 11.43,9.71 v11.75,9.71 12.06,9.71 C10.2
N$8
  Top 0.2: D4.C 2.38,13.34 1.59,14.13 R12.2
N$9
  Top 0.2: R12.1 2.36,16.06 2.86,15.55 IC3.1
N$10
  Top 0.2: R11.2 2.2,17.96 2.5,17.66 IC3.5
N$13  (via drill 0.3)
  Top 0.2: R8.1 19.21,3.17 v18.73,2.7
  Route2 0.2: v9.21,21.11 8.45,20.35 8.45,15.71 6.38,13.63 6.38,10.62 6.91,10.08 10.19,10.08 11.73,8.54 13.43,8.54 18.73,3.24 v18.73,2.7
  Bottom 0.2: J6.3 13.2,21.57 12.86,21.91 10,21.91 v9.21,21.11
SCL  (via drill 0.3)
  Top 0.2: IC8.7 5.46,21.05 v7.14,19.37 | v35.56,20.32 36.18,20.94 IC1.39
  Route2 0.2: v7.14,19.37 7.7,18.81 7.7,15.95 5.64,13.9 5.64,10.27 7.39,8.53 9.41,8.53 v11.11,6.83
  Route15 0.2: v35.56,20.32 35,20.88 33.9,20.88 33.66,20.64 33.66,18.14 33.21,17.7 33.21,14.48 31.59,12.86 30.04,12.86 25.43,8.25 12.54,8.25 v11.11,6.83
  Bottom 0.2: v11.11,6.83 11.2,6.74 J4.4 | R10.2 v35.56,20.32
SD_CLK  (via drill 0.3)
  Top 0.2: R28.1 16.35,3.49 v16.11,3.73 15.72,4.13 14.61,4.13 14.2,4.53 SD1.SCK | IC1.32 36.35,12.06 v36.2,11.91
  Route15 0.2: v36.2,11.91 36.2,11.11 33.5,8.41 33.5,6.03 31.09,3.62 19.87,3.62 19.72,3.47 18.41,3.47 18.14,3.73 v16.11,3.73
SD_CMD  (via drill 0.3)
  Top 0.2: R26.1 11.27,3.49 v11.43,3.65 12,4.22 SD1.MOSI | IC1.31 36.96,10.79 36.53,11.23 v35.42,11.23
  Route15 0.2: v35.42,11.23 33.03,8.84 33.03,6.11 30.91,3.98 19.73,3.98 19.62,3.87 18.57,3.87 18.16,4.29 15.83,4.29 15.19,3.65 v11.43,3.65
SD_DAT  (via drill 0.3)
  Top 0.2: SD1.MISO 16.4,4.91 17.62,3.69 17.62,3.65 | R27.1 17.62,3.65 | IC1.33 36.67,13.34 v35.4,12.06 | v18.89,4.45 18.41,4.45 17.62,3.65
  Route15 0.2: v35.4,12.06 32.54,9.21 32.54,6.13 30.75,4.34 19,4.34 v18.89,4.45
SD_ENABLE
  Top 0.2: IC1.25 35.26,2.24 34.67,1.65 32.72,1.65 32.03,0.97 8,0.97 7.31,1.66 7.31,1.96 Q2.1
SD_SW  (via drill 0.3)
  Top 0.2: R29.1 9.98,3.04 v9.05,3.97 9.05,6.03 9.37,6.35 9.37,7.94 8.98,8.32 SD1.SW1 | IC1.34 36.99,14.61 34.69,12.31 34.68,12.31 v34.52,12.15
  Route15 0.2: v9.05,3.97 9.3,4.22 15.25,4.22 16.02,5 19.12,5 19.42,4.7 30.61,4.7 32.14,6.23 32.14,9.77 v34.52,12.15
SDA  (via drill 0.3)
  Top 0.2: IC8.8 5.61,21.55 6.84,20.32 v7.14,20.32 | v34.29,20.32 34.92,19.68 IC1.38
  Route2 0.2: v7.14,20.32 8.1,19.36 8.1,15.85 6.02,13.78 6.02,10.4 7.52,8.9 9.82,8.9 11.91,6.82 v11.91,6.67
  Route15 0.2: v34.29,20.32 34.29,18.26 33.59,17.56 33.59,14.32 31.66,12.38 30.07,12.38 25.57,7.89 13.12,7.89 v11.91,6.67
  Bottom 0.2: v11.91,6.67 12.2,6.37 J4.3 | R9.2 v34.29,20.32
SDIO_3V3
  Top 0.305: C7.2 12.41,3.04 11.41,2.04 R26.2 R29.2 8.48,2.04 Q2.3 | R27.2 R28.2 14.93,2.04 14.27,2.69 14.16,2.69 C6.2
  Top 0.508: C7.2 13.18,3.04 | 13.18,3.04 C6.2 | SD1.VCC 13.1,3.11 13.18,3.04
USB-DN
  Bottom 0.2: R33.2 32.86,12.06 33.18,11.75 33.18,9.53 32.78,9.13 D3.1 33.13,8.31 J1.B7 33.13,6.46 33.02,6.35 32.2,6.35 32.13,6.42 J1.A7
USB-DP
  Bottom 0.2: D3.2 32.33,8.31 32.33,8.27 32.63,7.96 J1.A6 | D3.2 31.98,9.13 31.61,9.5 R34.2 | J1.B6 31.64,8.3 D3.2
V_LED  (via drill 0.3)
  Top 0.2: 40.62,14.45 R1.2
  Top 0.254: v39.85,16.99 39.85,15.22 40.62,14.45
  Route2 0.2: v39.85,16.99 39.85,20.89 36.44,24.29 4.19,24.29 2.44,22.54 v2.38,22.54
  Route2 0.406: v2.38,22.54 2.36,22.52 2.36,6.53 v3.02,5.87
  Bottom 0.406: SW4.5 2.97,5.83 v3.02,5.87 | v2.38,22.54 2.38,21.41 2.86,20.93 C18.2 3.17,20.81 3.94,20.05 4.25,20.05 D1.4
VBAT  (via drill 0.3)
  Top 0.2: IC8.2 1.66,21.05 v1.11,21.59
  Route15 0.2: v1.11,21.59 4.5,18.2 v4.5,16.35
  Route15 0.508: v25.56,12.22 25.56,12.1 22.57,9.11 16.16,9.11 9.08,16.19 v6.99,16.19
  Bottom 0.305: D2.6 27.21,12.13 C17.2
  Bottom 0.508: v25.56,12.22 25.72,12.38 C17.2
  other vias: 5.08,16.4
  pour Top (no thermals): 7.14,15.88 7.14,16.51 5.4,16.51 5.24,16.67 4.29,16.67 4.13,16.51 4.13,15.4 4.6,14.92 6.19,14.92
  pour Bottom (no thermals): 4.34,16.62 4,16.28 4,12.47 7.33,12.47 7.33,13.58 5.91,13.58 5.27,14.21 5.27,16.62
VIN  (via drill 0.3)
  Top 0.508: C22.2 8.26,23.31 v8.26,23.21 IC5.3 | IC6.3 v11.75,23.21 11.75,23.31 C21.2
  Route2 0.508: v11.75,23.21 v8.26,23.21 7.27,23.21 3.79,19.73 3.79,10.98 7.94,6.83 v7.94,5.24
  Bottom 0.508: C24.2 8.26,23.31 v8.26,23.21 | v7.94,5.24 7.35,5.83 SW4.2
VSWITCHED  (via drill 0.3)
  Top 0.2: v40.8,15.41 40.95,15.41 41.43,14.92 IC9.D3
  Route2 0.508: v42.7,10.79 42.7,13.5 v40.8,15.41 39.21,15.41 38.64,15.98 35.35,15.98 v34.61,15.24 33.69,14.33 33.69,11.44 32.89,10.64 30.7,10.64 v29.14,10.64 27.51,10.64 24.27,7.39 23.52,7.39 20.93,4.8 20.93,2.72 19.51,1.31 8.38,1.31 6.03,3.65 6.03,7.14 v5.4,7.78
  Bottom 0.254: 27.71,10.74 27.82,10.64 27.71,10.53
  Bottom 0.305: D2.7 27.71,10.74 | D2.2 27.71,10.53
  Bottom 0.406: SW4.6 2.73,7.33 3.17,7.78 v5.4,7.78 5.85,7.33 SW4.3 | 27.82,10.64 v29.14,10.64
  Bottom 0.508: IC7.5 v34.61,15.24 34.61,16.45 33.97,17.08 C25.2
  pour Top (no thermals): 41.91,14.13 43.18,14.13 43.18,9.53 42.23,9.53 42.23,12.86 41.91,13.18
VUSB  (via drill 0.3)
  Top 0.508: C23.2 4.76,18.44 IC3.4 5.28,17.66 v5.48,17.86 | v35.08,8.41 v30,8.41 | v5.08,11.43 4.66,11.85 D4.A
  Route15 0.508: v5.48,17.86 5.85,17.49 5.85,12.2 v5.08,11.43 5.08,11.22 10.34,5.96 12.31,5.96 13.69,7.34 26.38,7.34 v26.75,7.71 27.58,8.54 28.8,8.54 28.92,8.41 v30,8.41
  Bottom 0.305: D2.3 27.21,9.14 C28.2
  Bottom 0.406: C28.2 26.96,7.92 v26.75,7.71
  Bottom 0.508: J1.VBUS 29.93,8.35 v30,8.41 | v35.08,8.41 34.84,8.16 J1.VBUS2

### Text on the board
tPlace: Lora Ant. | WiFi Ant. | open / Hardware | V1.0 | senseBox / Eye
bPlace: GPIO | LED | Rst | - | lächeln | Bat | Boot | + | on|off | Sw | Qwiic | 5V | Out